# EasyEDA Pro project ProPrj_nigeria__2025-12-29.epro, schematic Schematic1

## Sheets
1 P1: Board Name: Board1; Create Date: 2025-03-15; Page Name: P1; Project Name: nigeria_; Schematic Name: Schematic1; Update Date: 2025-03-15; Company: EasyEDA.com; Page Size: A4; Version: V1.0
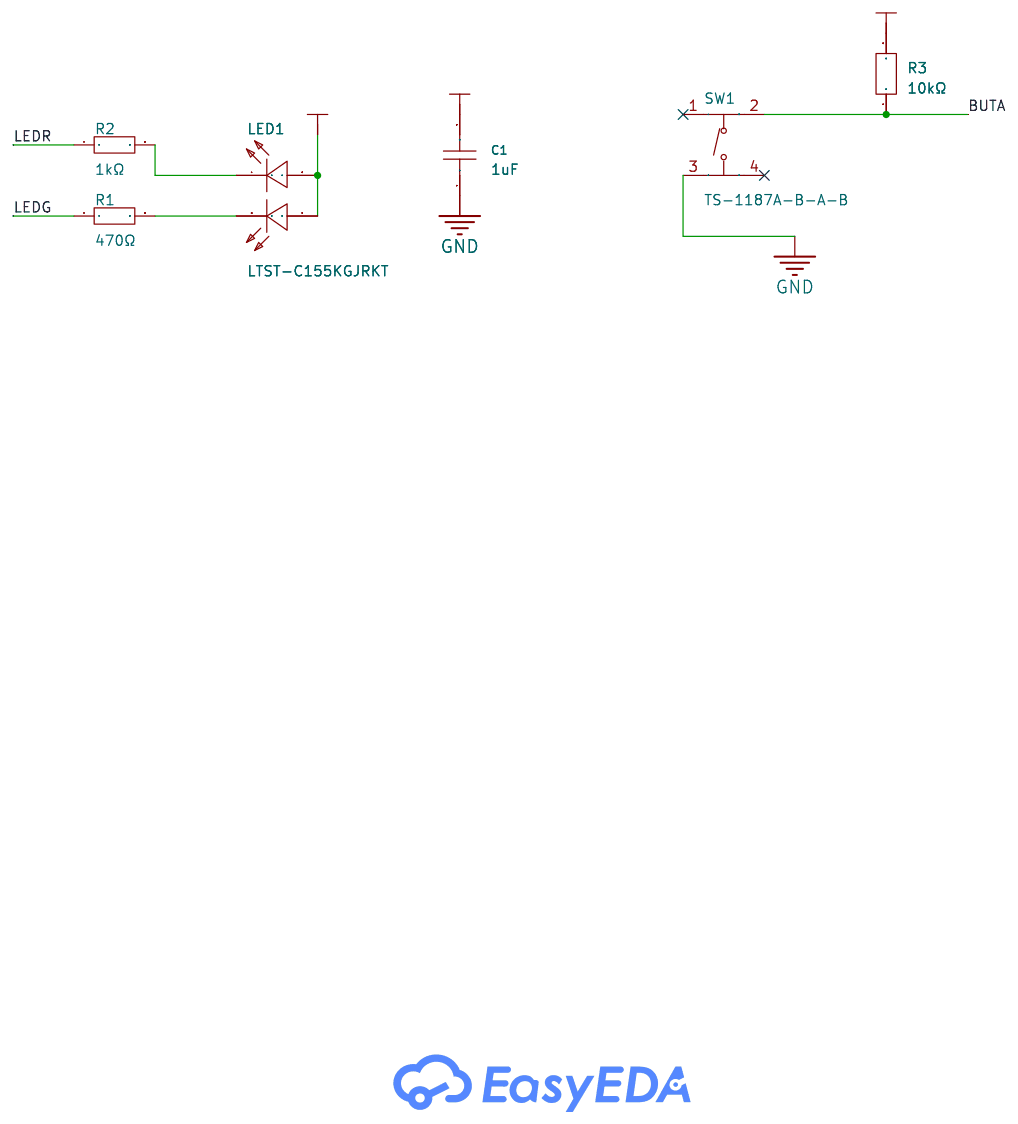
[diagram p0: P1]
2 P2: Page Name: P2; Update Date: 2025-03-19
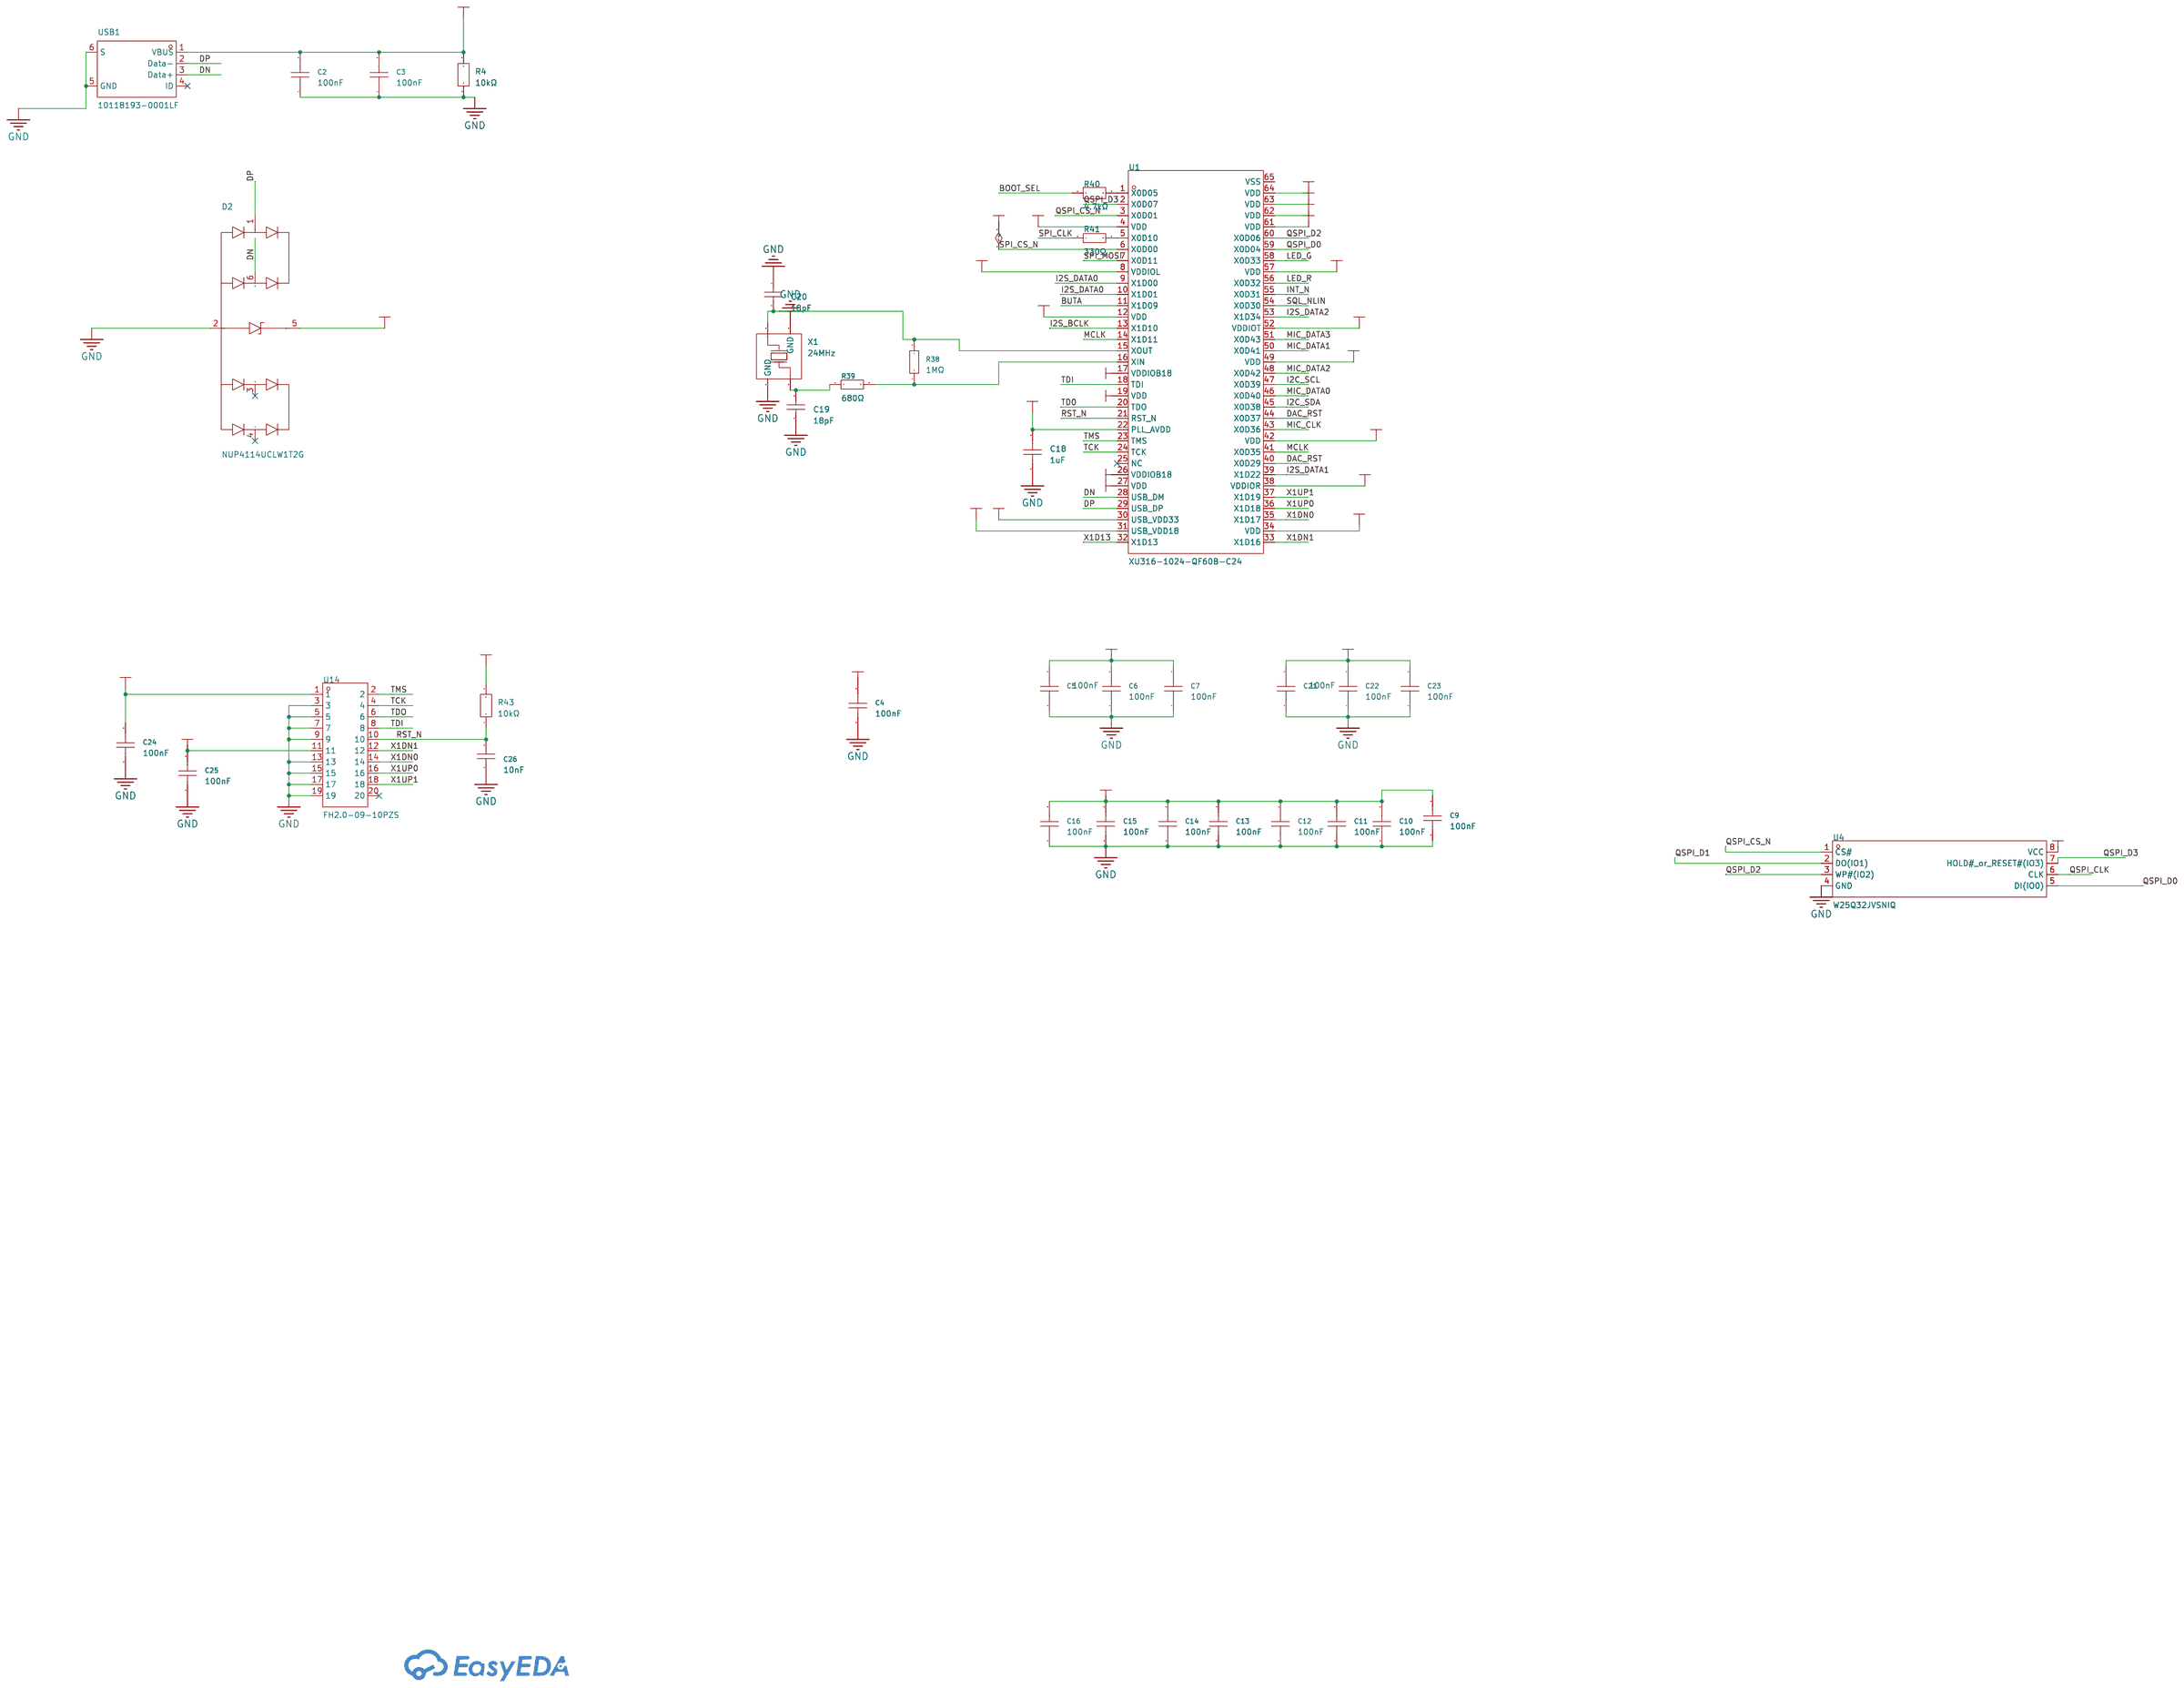
[diagram p1: P2]
3 P3: Page Name: P3; Update Date: 2025-03-16
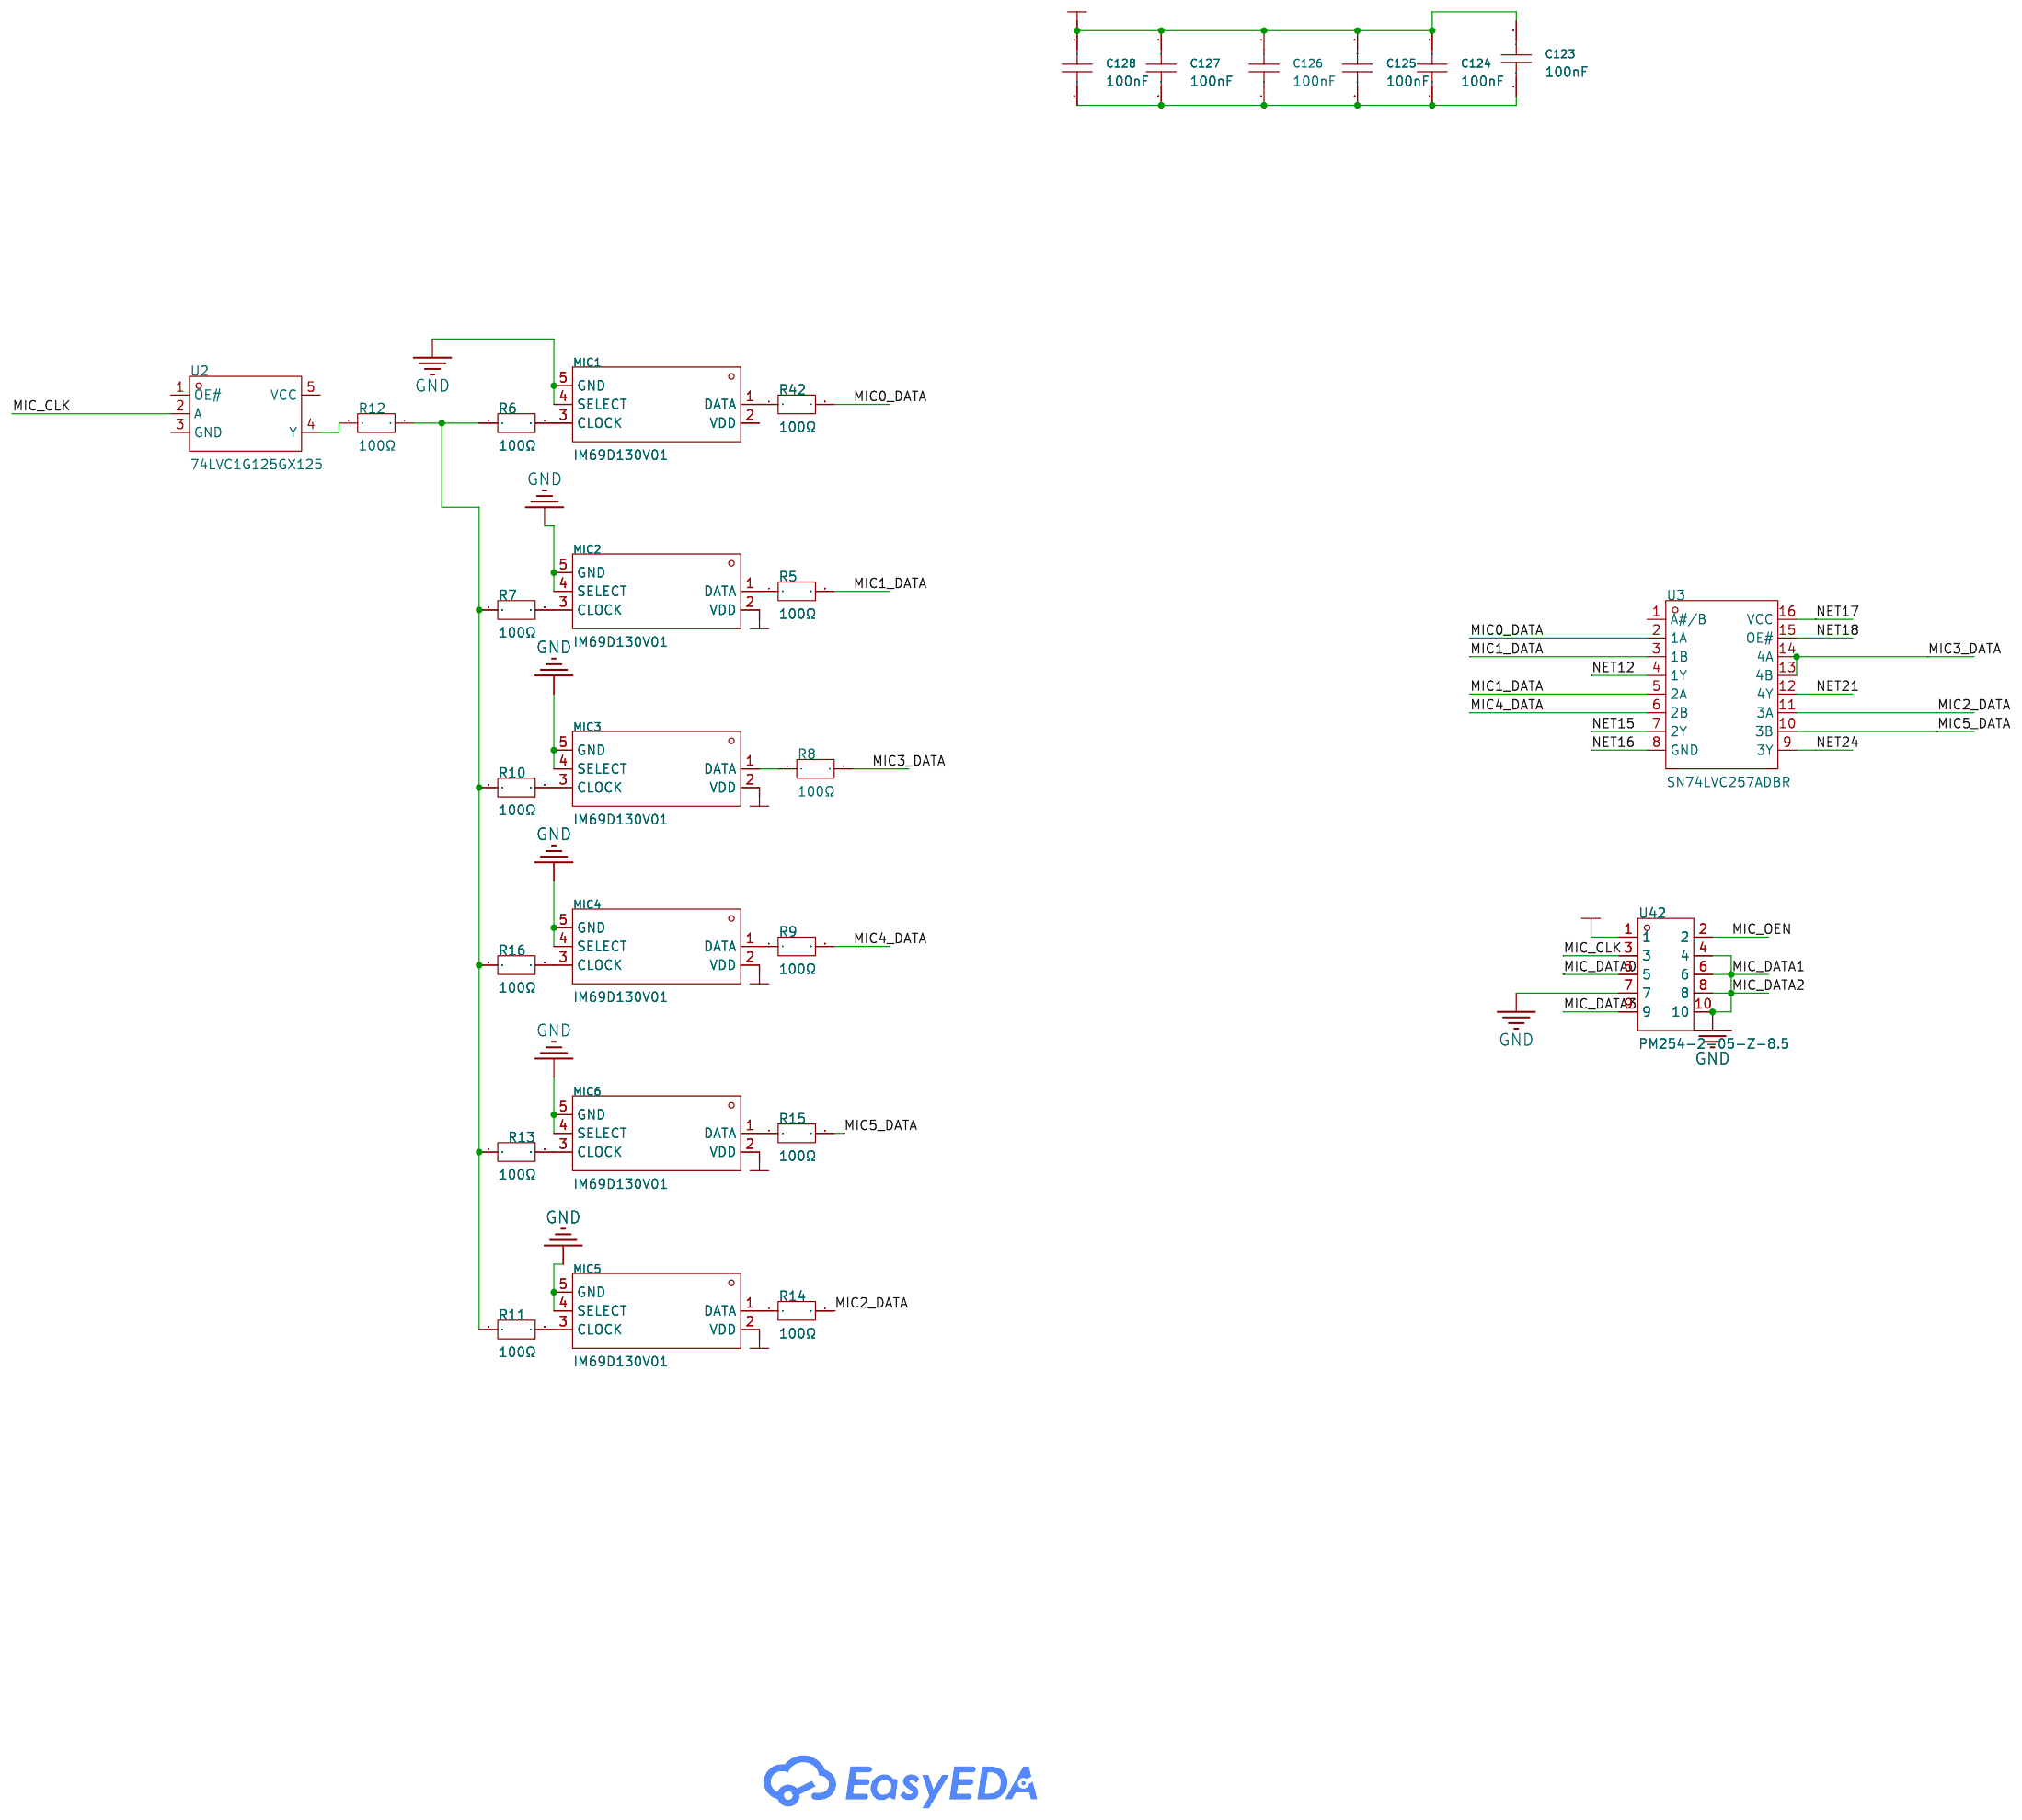
[diagram p2: P3]
4 P4: Page Name: P4; Update Date: 2025-03-16
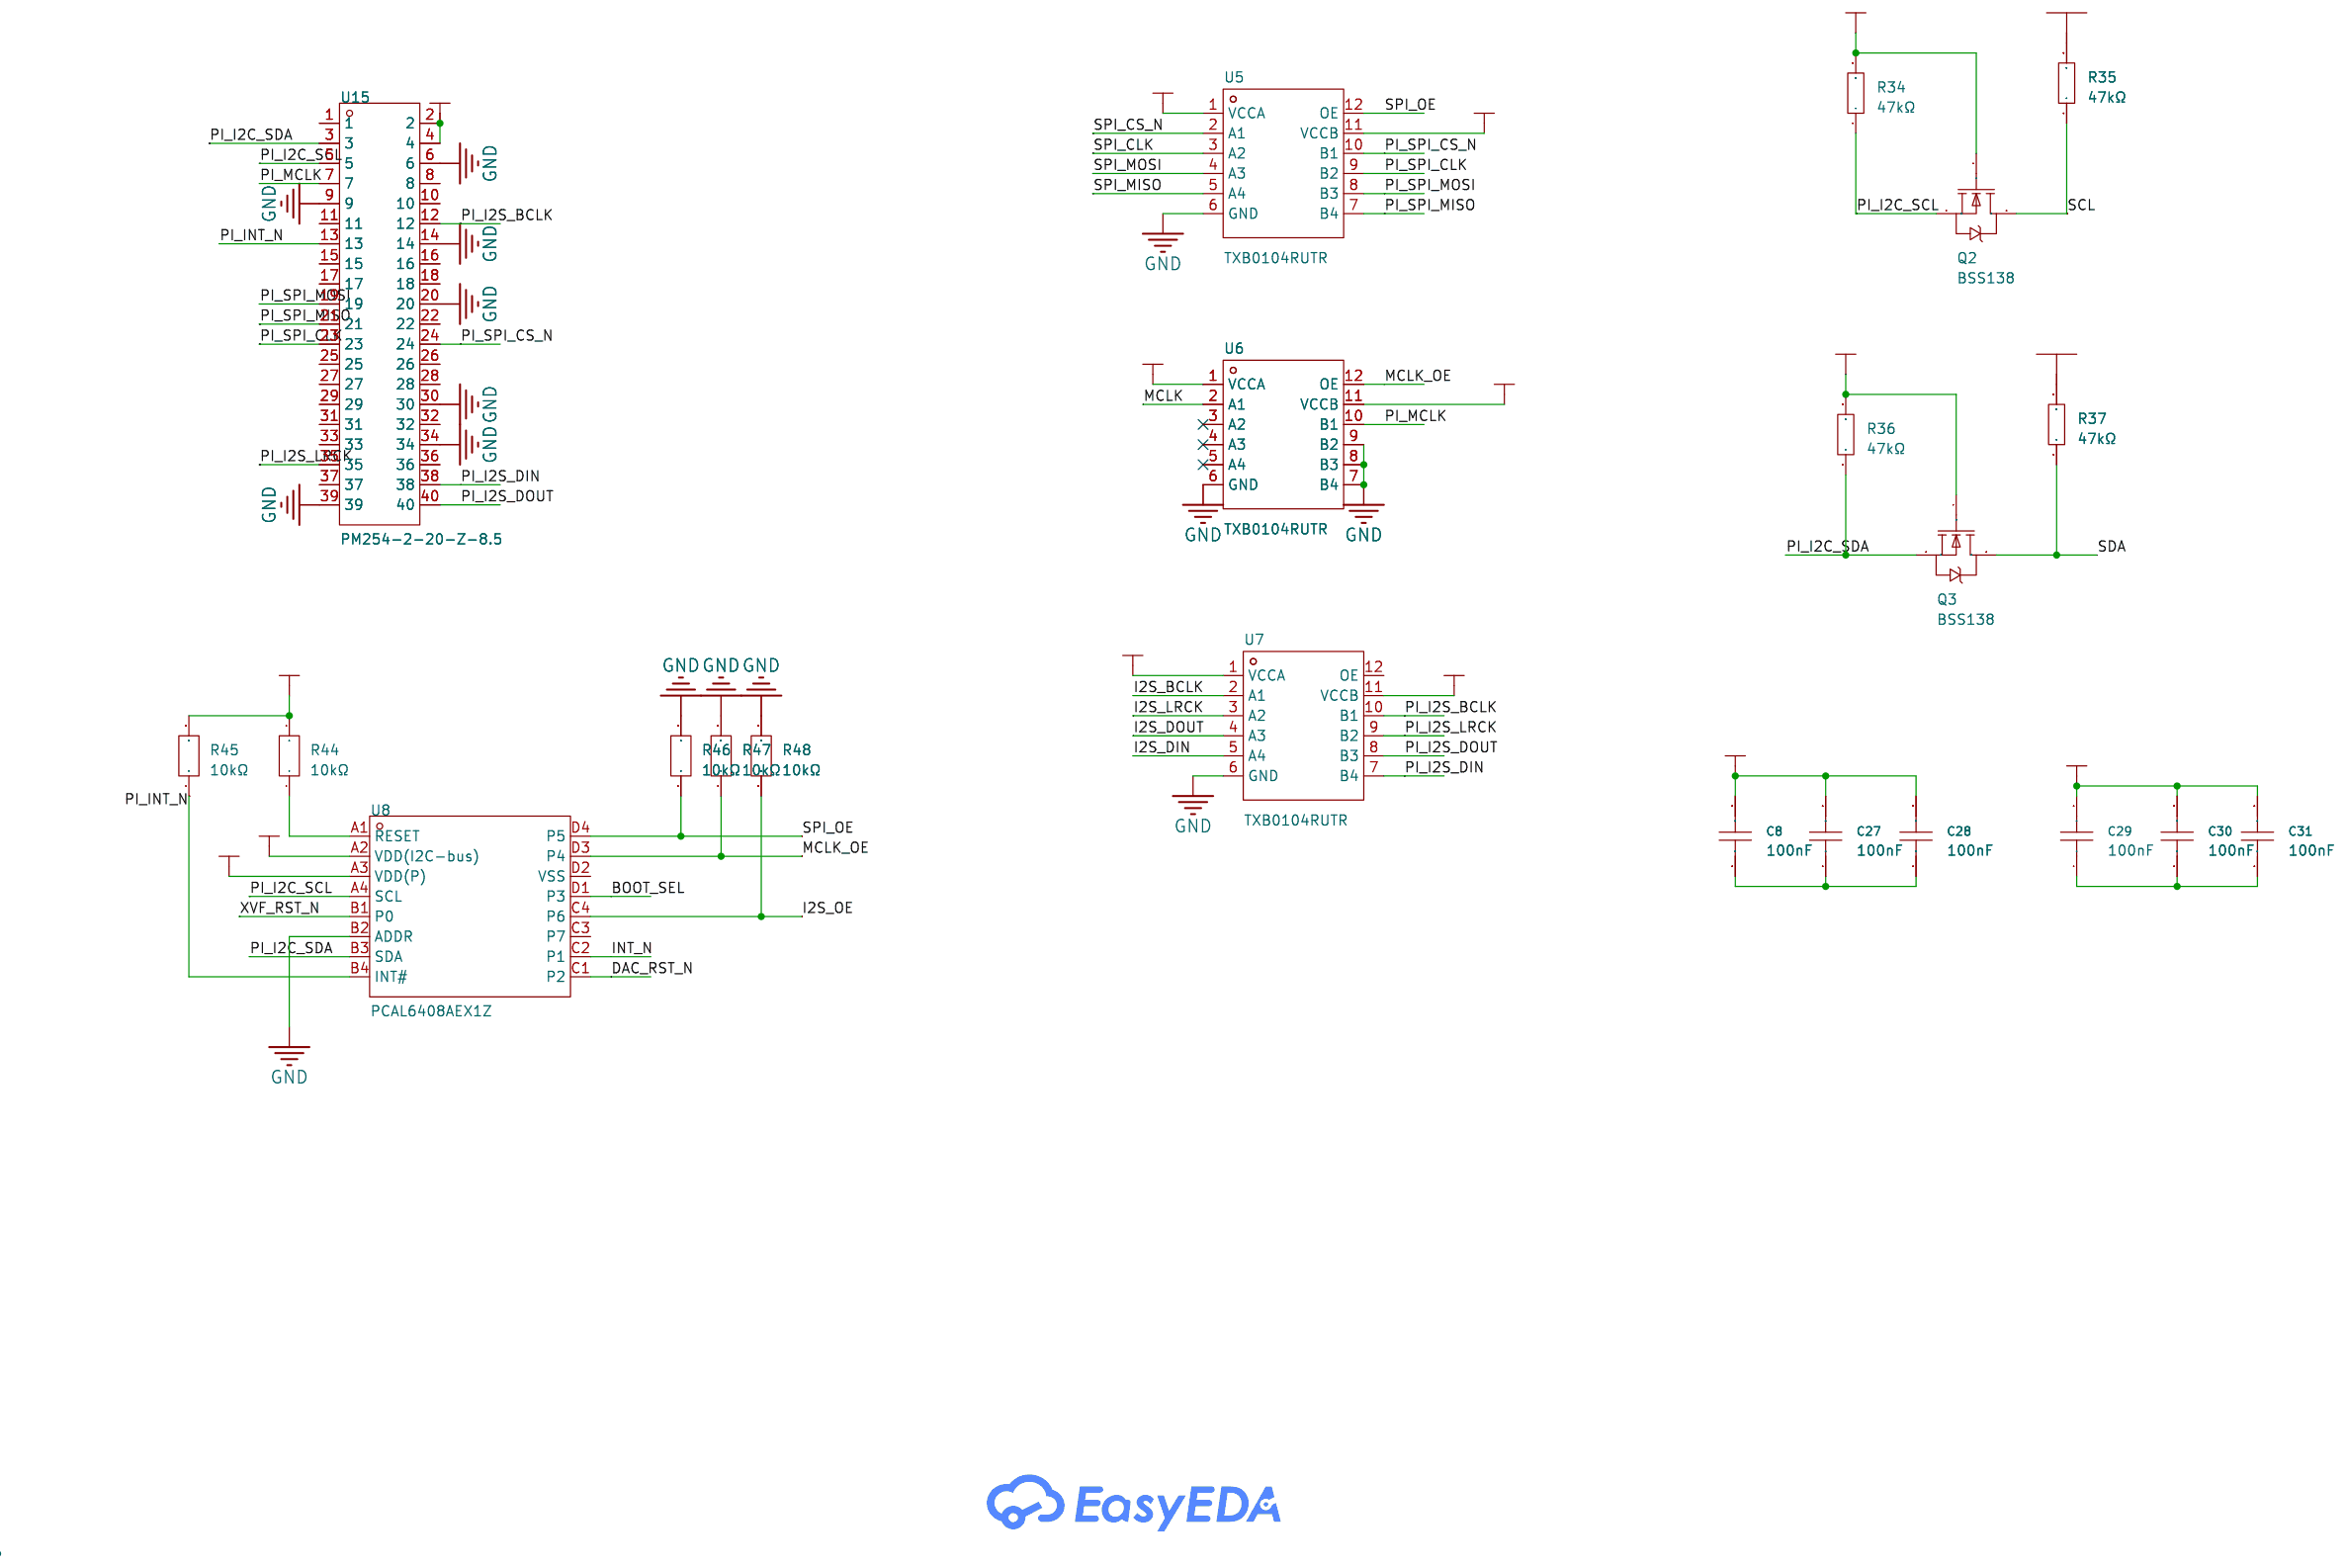
[diagram p3: P4]
5 P5: Page Name: P5; Update Date: 2025-03-16
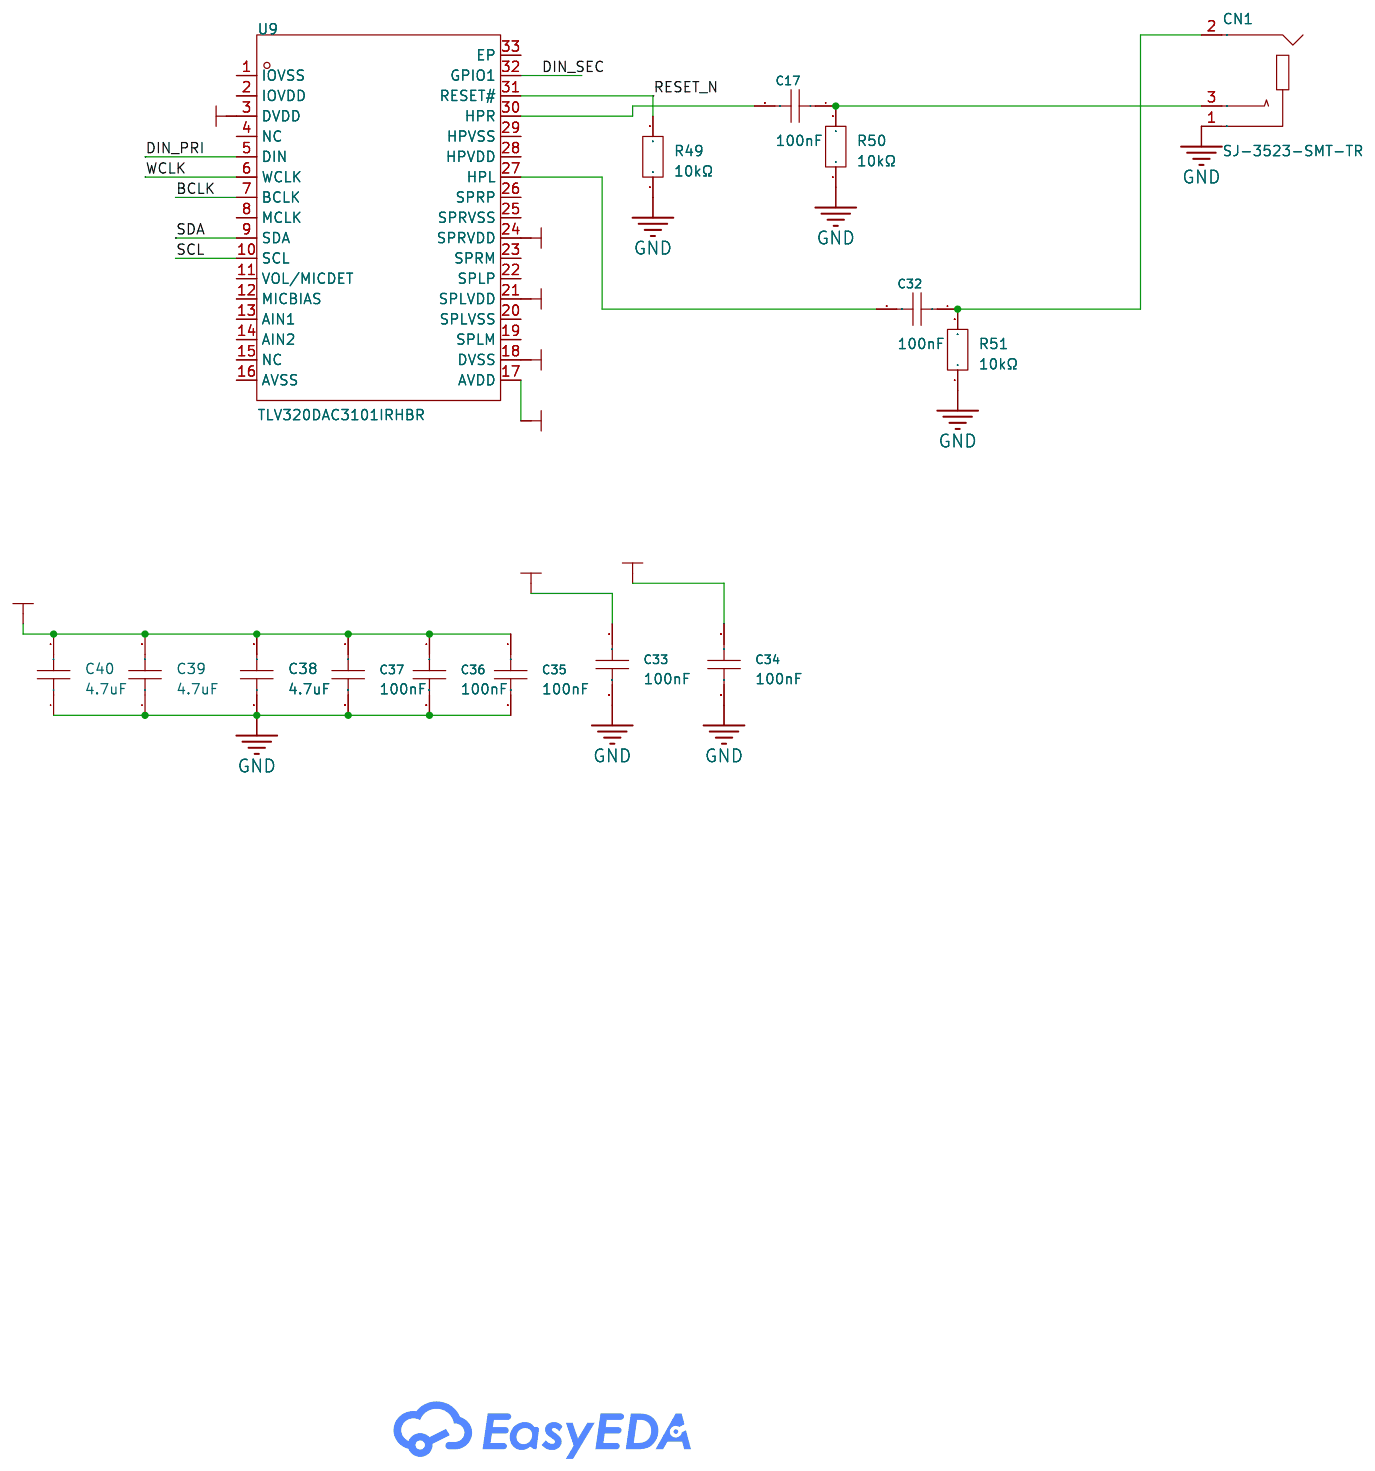
[diagram p4: P5]
6 P6: Page Name: P6; Update Date: 2025-03-16
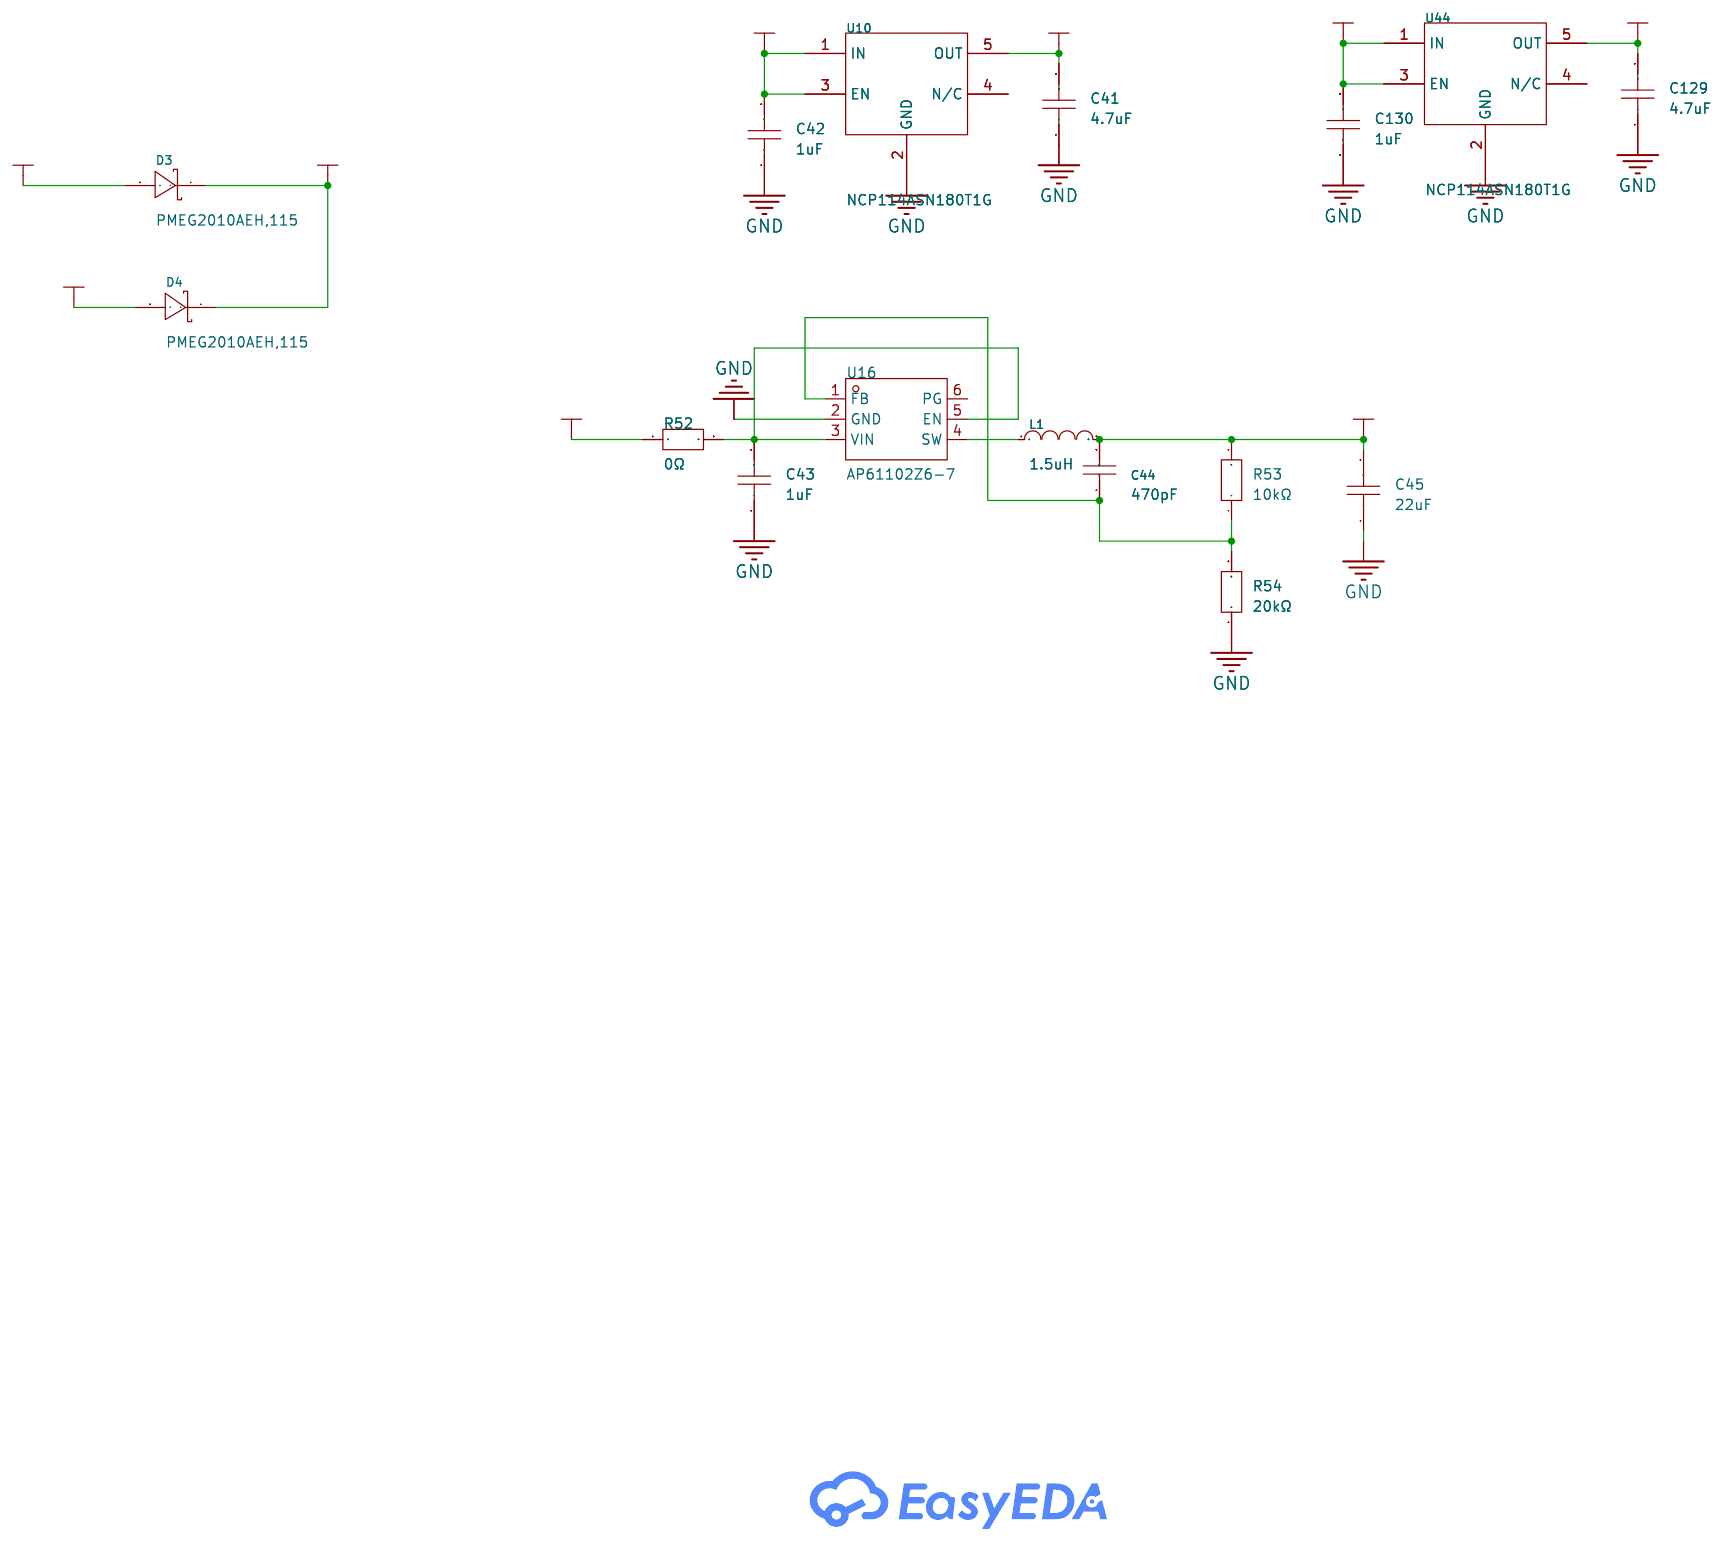
[diagram p5: P6]
7 P7: Create Date: 2025-03-16; Page Name: P7; Update Date: 2025-03-16
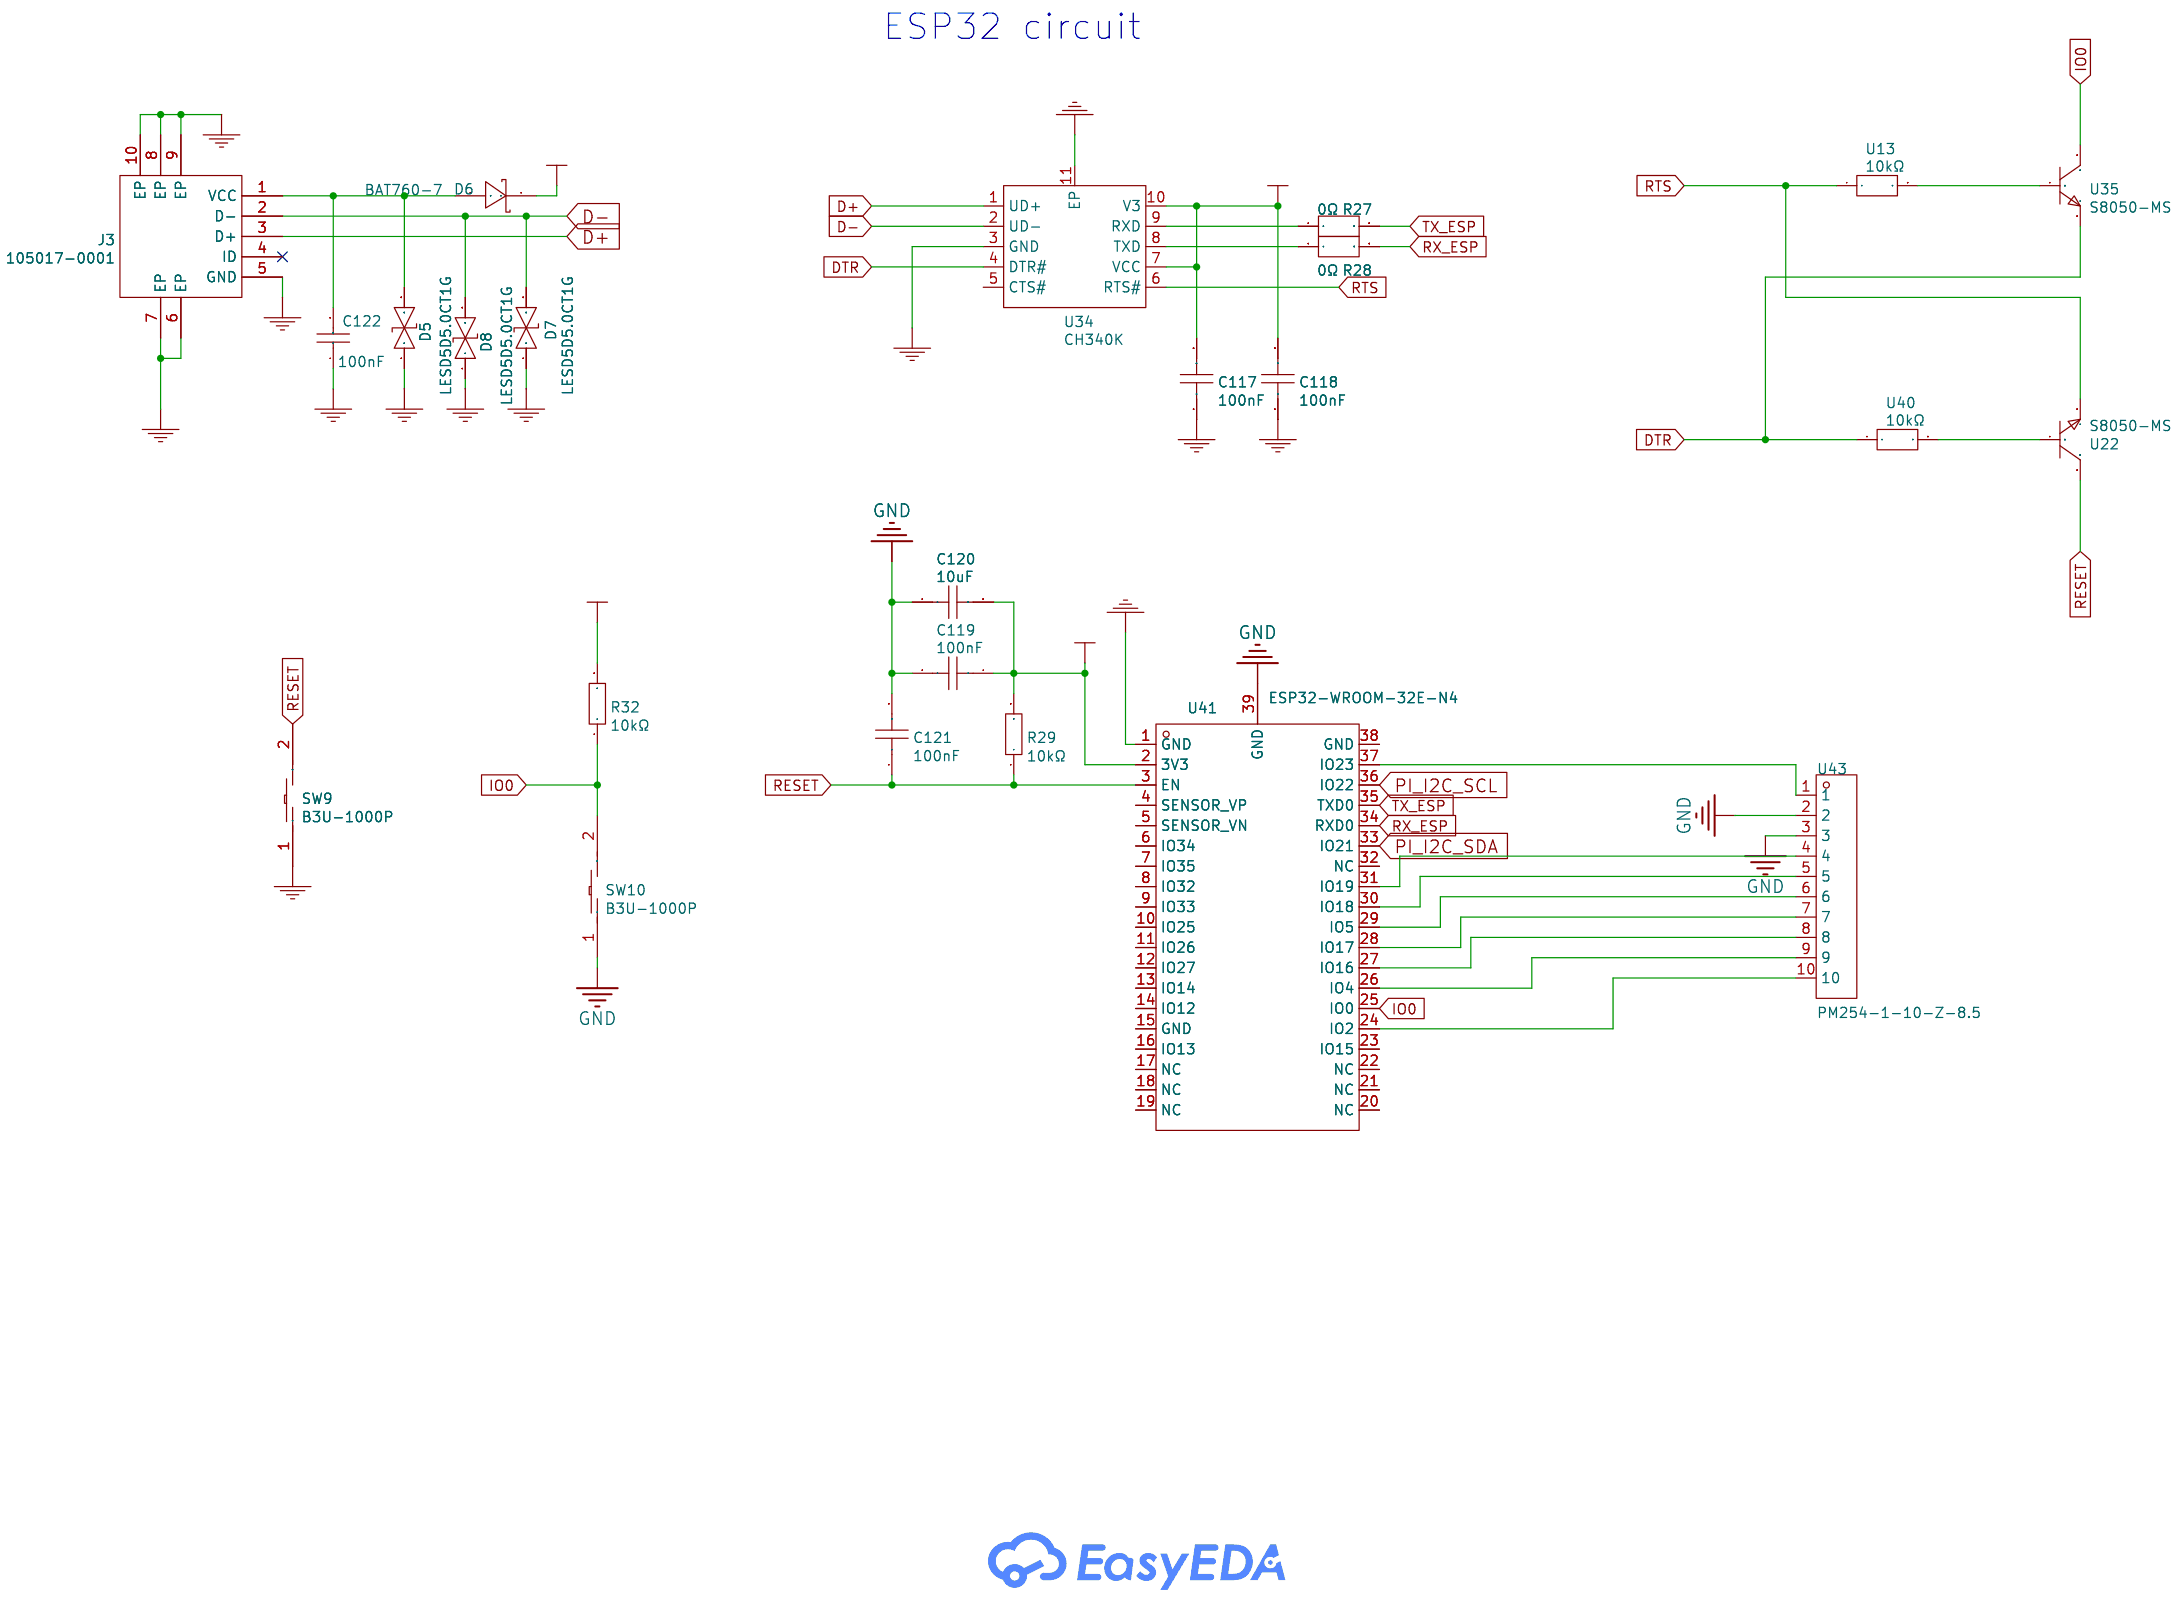
[diagram p6: P7]

## Parts
sheet P1
C1  1uF  [C0603]
LED1  LTST-C155KGJRKT  [LED-ARRAY-SMD_4P-L3.2-W2.7-BR]
R1  470Ω  [R0603]
R2  1kΩ  [R0603]
R3  10kΩ  [R0603]
SW1  TS-1187A-B-A-B  [SW-SMD_4P-L5.1-W5.1-P3.70-LS6.5-TL_H1.5]
sheet P2
C2  100nF  [C0603]
C3  100nF  [C0603]
C4  100nF  [C0603]
C5  100nF  [C0603]
C6  100nF  [C0603]
C7  100nF  [C0603]
C9  100nF  [C0603]
C10  100nF  [C0603]
C11  100nF  [C0603]
C12  100nF  [C0603]
C13  100nF  [C0603]
C14  100nF  [C0603]
C15  100nF  [C0603]
C16  100nF  [C0603]
C18  1uF  [C0603]
C19  18pF  [C0603]
C20  18pF  [C0603]
C21  100nF  [C0603]
C22  100nF  [C0603]
C23  100nF  [C0603]
C24  100nF  [C0603]
C25  100nF  [C0603]
C26  10nF  [C0603]
D2  NUP4114UCLW1T2G  [SOT-363-6_L2.0-W1.3-P0.65-LS2.3-BL]
R4  10kΩ  [R0603]
R38  1MΩ  [R0603]
R39  680Ω  [R0805]
R40  4.7kΩ  [R0603]
R41  330Ω  [R0603]
R43  10kΩ  [R0603]
U1  XU316-1024-QF60B-C24  [QFN-60_L7.0-W7.0-P0.40-TL-EP_XU316-1024]
U4  W25Q32JVSNIQ  [SOP-8_L4.9-W3.9-P1.27-LS6.0-BL]
U14  FH2.0-09-10PZS  [HDR-TH_20P-P2.00-V-F-R2-C10-S2.00-3]
USB1  10118193-0001LF  [MICRO-USB-SMD_10118193-0001LF]
X1  24MHz  [CRYSTAL-SMD_4P-L3.2-W2.5-BL-1]
sheet P3
C123  100nF  [C0603]
C124  100nF  [C0603]
C125  100nF  [C0603]
C126  100nF  [C0603]
C127  100nF  [C0603]
C128  100nF  [C0603]
MIC1  IM69D130V01  [MIC-SMD_5P-L4.0-W3.0-P0.70-TR_IM69D130V01]
MIC2  IM69D130V01  [MIC-SMD_5P-L4.0-W3.0-P0.70-TR_IM69D130V01]
MIC3  IM69D130V01  [MIC-SMD_5P-L4.0-W3.0-P0.70-TR_IM69D130V01]
MIC4  IM69D130V01  [MIC-SMD_5P-L4.0-W3.0-P0.70-TR_IM69D130V01]
MIC5  IM69D130V01  [MIC-SMD_5P-L4.0-W3.0-P0.70-TR_IM69D130V01]
MIC6  IM69D130V01  [MIC-SMD_5P-L4.0-W3.0-P0.70-TR_IM69D130V01]
R5  100Ω  [R0603]
R6  100Ω  [R0603]
R7  100Ω  [R0603]
R8  100Ω  [R0603]
R9  100Ω  [R0603]
R10  100Ω  [R0603]
R11  100Ω  [R0603]
R12  100Ω  [R0603]
R13  100Ω  [R0603]
R14  100Ω  [R0603]
R15  100Ω  [R0603]
R16  100Ω  [R0603]
R42  100Ω  [R0603]
U2  74LVC1G125GX125  [X2SON-5_L0.8-W0.8-P0.48-BL-EP]
U3  SN74LVC257ADBR  [SSOP-16_L6.2-W5.3-P0.65-LS7.8-BL]
U42  PM254-2-05-Z-8.5  [HDR-TH_10P-P2.54-V-F-R2-C5-S2.54]
sheet P4
C8  100nF  [C0603]
C27  100nF  [C0603]
C28  100nF  [C0603]
C29  100nF  [C0603]
C30  100nF  [C0603]
C31  100nF  [C0603]
Q2  BSS138  [SOT-23-3_L2.9-W1.6-P1.90-LS2.8-BR]
Q3  BSS138  [SOT-23-3_L2.9-W1.6-P1.90-LS2.8-BR]
R34  47kΩ  [R0603]
R35  47kΩ  [R0603]
R36  47kΩ  [R0603]
R37  47kΩ  [R0603]
R44  10kΩ  [R0603]
R45  10kΩ  [R0603]
R46  10kΩ  [R0603]
R47  10kΩ  [R0603]
R48  10kΩ  [R0603]
U5  TXB0104RUTR  [UQFN-12_L2.0-W1.7-P0.40-BL]
U6  TXB0104RUTR  [UQFN-12_L2.0-W1.7-P0.40-BL]
U7  TXB0104RUTR  [UQFN-12_L2.0-W1.7-P0.40-BL]
U8  PCAL6408AEX1Z  [X2QFN-16_L1.6-W1.6-R4-C4-P0.4-TL]
U15  PM254-2-20-Z-8.5  [HDR-TH_40P-P2.54-V-F-R2-C20-S2.54]
sheet P5
C17  100nF  [C0603]
C32  100nF  [C0603]
C33  100nF  [C0603]
C34  100nF  [C0603]
C35  100nF  [C0603]
C36  100nF  [C0603]
C37  100nF  [C0603]
C38  4.7uF  [C0603]
C39  4.7uF  [C0603]
C40  4.7uF  [C0603]
CN1  SJ-3523-SMT-TR  [AUDIO-SMD_SJ-3523-SMT-TR]
R49  10kΩ  [R0603]
R50  10kΩ  [R0603]
R51  10kΩ  [R0603]
U9  TLV320DAC3101IRHBR  [VQFN-32_L5.0-W5.0-P0.50-TL-EP3.5]
sheet P6
C41  4.7uF  [C0603]
C42  1uF  [C0603]
C43  1uF  [C0603]
C44  470pF  [C0603]
C45  22uF  [C0603]
C129  4.7uF  [C0603]
C130  1uF  [C0603]
D3  PMEG2010AEH,115  [SOD-123F_L2.8-W1.8-LS3.7-RD]
D4  PMEG2010AEH,115  [SOD-123F_L2.8-W1.8-LS3.7-RD]
L1  1.5uH  [L0806]
R52  0Ω  [R0603]
R53  10kΩ  [R0603]
R54  20kΩ  [R0603]
U10  NCP114ASN180T1G  [TSOP-5_L3.0-W1.5-P0.95-LS2.8-BR]
U16  AP61102Z6-7  [SOT-563-6_L1.6-W1.2-P0.50-LS1.6-BL]
U44  NCP114ASN180T1G  [TSOP-5_L3.0-W1.5-P0.95-LS2.8-BR]
sheet P7
C117  100nF  [C0603]
C118  100nF  [C0603]
C119  100nF  [C0603]
C120  10uF  [C0603]
C121  100nF  [C0603]
C122  100nF  [C0402_NEW]
D5  LESD5D5.0CT1G  [SOD-523_L1.2-W0.8-LS1.6-BI]
D6  BAT760-7  [SOD-323_L1.8-W1.3-LS2.5-RD]
D7  LESD5D5.0CT1G  [SOD-523_L1.2-W0.8-LS1.6-BI]
D8  LESD5D5.0CT1G  [SOD-523_L1.2-W0.8-LS1.6-BI]
J3  105017-0001  [MICRO-USB-SMD_105017-0001]
R27  0Ω  [R0603]
R28  0Ω  [R0603]
R29  10kΩ  [R0603]
R32  10kΩ  [R0603]
SW9  B3U-1000P  [KEY-SMD_B3U-1000PM]
SW10  B3U-1000P  [KEY-SMD_B3U-1000PM]
U13  10kΩ  [R0603]
U22  S8050-MS  [SOT-23-3_L2.9-W1.3-P1.90-LS2.4-BR]
U34  CH340K  [ESOP-10_L4.9-W3.9-P1.00-LS6.2-BL-EP]
U35  S8050-MS  [SOT-23-3_L2.9-W1.3-P1.90-LS2.4-BR]
U40  10kΩ  [R0603]
U41  ESP32-WROOM-32E-N4  [WIFI-SMD_ESP32-WROOM-32E]
U43  PM254-1-10-Z-8.5  [HDR-TH_10P-P2.54-V-F]

## Library data of the parts
C1 = TCC0603X5R105K250CT: Capacitance:1uF Tolerance:±10% Tolerance:±10% Voltage Rated: Temperature Coefficient:; LCSC Part Name: 1uF ±10% 25V; Supplier Part: C696843; Manufacturer: CCTC(三环); Supplier Footprint: 0603; JLCPCB Part Class: Extended Part; Datasheet: https://atta.szlcsc.com/upload/public/pdf/source/20200707/C696841_89A2C111301AB76AE7642008585E7A11.pdf; Supplier: LCSC; Tolerance: ±10%
LED1 = LTST-C155KGJRKT: Emitted Color:Red,Green-yellow Forward Voltage (VF):2V；2V Forward Voltage (VF):2V；2V Power Dissipation:75mW Forward Current:20mA Dominant Wavelength:571nm；631nm Dominant Wavelength:571nm；631nm Peak Wavelength:639nm；574nm Diode Configuration:- Lens Color:无; LCSC Part Name: 红灯,普绿/黄绿; Supplier Part: C115448; Manufacturer: LITEON(光宝); Supplier Footprint: 1210; JLCPCB Part Class: Extended Part; Datasheet: https://atta.szlcsc.com/upload/public/pdf/source/20170616/1497588043425.pdf; Supplier: LCSC; Emitted Color: Red,Green-yellow; Forward Voltage (VF): 2V；2V; Power Dissipation: 75mW; Forward Current: 20mA; Dominant Wavelength: 571nm；631nm; Peak Wavelength: 639nm；574nm; Lens Color: 无色透明透镜; Luminous Intensity: 45mcd；35mcd; Viewing Angle: 130°; Operating Temperature: -55℃~+85℃
R1 = ARG03FTC4700: Type:Thin Film Resistor Resistance: Tolerance:±1% Tolerance:±1% Power(Watts): Overload Voltage (Max): Temperature Coefficient:±25ppm/℃ Temperature Coefficient:±25ppm/℃ Operating Temperature Range:-55℃~+155℃ Operating Temperature Range:-55℃~+155℃; LCSC Part Name: 薄膜电阻 470Ω ±1% 100mW; Supplier Part: C218042; Manufacturer: Viking(光颉); Supplier Footprint: 0603; JLCPCB Part Class: Extended Part; Datasheet: https://atta.szlcsc.com/upload/public/pdf/source/20200117/C485675_99063924B4564AF910B7BE66DA8EFA49.pdf; Supplier: LCSC; Type: Thin Film Resistor; Tolerance: ±1%; Temperature Coefficient: ±25ppm/℃; Operating Temperature Range: -55℃~+155℃
R2 = AF0603FR-071KL: Type:Thick Film Resistors Resistance: Tolerance:±1% Tolerance:±1% Power(Watts): Overload Voltage (Max): Temperature Coefficient:±100ppm/℃ Temperature Coefficient:±100ppm/℃ Operating Temperature Range:-55℃~+155℃ Operating Temperature Range:-55℃~+155℃; LCSC Part Name: 厚膜电阻 1kΩ ±1% 100mW; Supplier Part: C144087; Manufacturer: YAGEO(国巨); Supplier Footprint: 0603; JLCPCB Part Class: Extended Part; Datasheet: https://atta.szlcsc.com/upload/public/pdf/source/20180521/C192909_BA60B361D36B958A4E76614D266D209B.pdf; Supplier: LCSC; Type: Thick Film Resistors; Tolerance: ±1%; Temperature Coefficient: ±100ppm/℃; Operating Temperature Range: -55℃~+155℃
R3 R4 R53 = RMCF0603FT10K0: Type:Thick Film Resistors Resistance:10kΩ Tolerance:±1% Tolerance:±1% Power(Watts):100mW Voltage-Supply(Max):75V Temperature Coefficient:±100ppm/℃ Temperature Coefficient:±100ppm/℃ Operating Temperature:-55℃~+155℃ Operating Temperature:-55℃~+155℃; LCSC Part Name: 厚膜电阻 10kΩ ±1% 100mW; Supplier Part: C2479067; Manufacturer: SEI(Stackpole Electronics Inc.); Supplier Footprint: 0603; JLCPCB Part Class: Extended Part; Datasheet: https://atta.szlcsc.com/upload/public/pdf/source/20210416/08FD20E6270D8D7CE8DA16B611AFBC44.pdf; Supplier: LCSC; Type: Thick Film Resistors; Tolerance: ±1%; Power(Watts): 100mW; Voltage-Supply(Max): 75V; Temperature Coefficient: ±100ppm/℃; Operating Temperature: -55℃~+155℃
SW1 = TS-1187A-B-A-B: Circuit:SPST Actuator Style:Round Button Operating Force:160gf Mounting Style:Brick nogging Switch Length:5.1mm Switch Width:5.1mm Switch Height:1.5mm Strike Gundam:不带 Contact Current:50mA Voltage Rating (DC):12V Insulation Resistance:- Actuator/Cap Color; LCSC Part Name: 5.1*5.1*1.5mm 立贴 轻触开关; Supplier Part: C318884; Manufacturer: XKB Connectivity(中国星坤); Supplier Footprint: SMD; JLCPCB Part Class: Basic Part; Datasheet: https://atta.szlcsc.com/upload/public/pdf/source/20200227/C318890_053E50208A88A7BA1965D8746000774E.pdf; Supplier: LCSC; Circuit: SPST; Actuator Style: Round Button; Operating Force: 160gf; Mounting Style: Brick nogging; Switch Length: 5.1mm; Switch Width: 5.1mm; Switch Height: 1.5mm; Strike Gundam: 不带; Contact Current: 50mA; Voltage Rating (DC): 12V; Actuator/Cap Color: 金色; With Lamp: No; Mechanical Life: 10万次; Operating Temperature: -30℃~+85℃
C2-C17 C21-C25 C27-C37 C123-C128 = TCC0603X7R104K101CT: Capacitance:100nF Tolerance:±10% Tolerance:±10% Voltage Rated: Temperature Coefficient:; LCSC Part Name: 100nF ±10% 100V; Supplier Part: C696916; Manufacturer: CCTC(三环); Supplier Footprint: 0603; JLCPCB Part Class: Extended Part; Datasheet: https://atta.szlcsc.com/upload/public/pdf/source/20200707/C696841_89A2C111301AB76AE7642008585E7A11.pdf; Supplier: LCSC; Tolerance: ±10%
C18 C42 C43 C130 = CL10A105KB8NNNC: Capacitance: Tolerance:±10% Tolerance:±10% Voltage Rated: Temperature Coefficient:; LCSC Part Name: 1uF ±10% 50V; Supplier Part: C15849; Manufacturer: SAMSUNG(三星); Supplier Footprint: 0603; JLCPCB Part Class: Basic Part; Datasheet: https://atta.szlcsc.com/upload/public/pdf/source/20160218/1457707763339.pdf; Supplier: LCSC; Tolerance: ±10%
C19 C20 = CL10C180JB8NNNC: Capacitance: Tolerance:±5% Tolerance:±5% Voltage Rated: Temperature Coefficient:; LCSC Part Name: 18pF ±5% 50V; Supplier Part: C1647; Manufacturer: SAMSUNG(三星); Supplier Footprint: 0603; JLCPCB Part Class: Basic Part; Datasheet: https://atta.szlcsc.com/upload/public/pdf/source/20160218/1457707763339.pdf; Supplier: LCSC; Tolerance: ±5%
C26 = 0603B103K500NT: Capacitance:10nF Tolerance:±10% Tolerance:±10% Voltage Rated: Temperature Coefficient:; LCSC Part Name: 10nF ±10% 50V; Supplier Part: C57112; Manufacturer: FH(风华); Supplier Footprint: 0603; JLCPCB Part Class: Basic Part; Datasheet: https://atta.szlcsc.com/upload/public/pdf/source/20200305/C486355_26A10D38EF8C2A5C37091D0039909270.pdf; Supplier: LCSC; Tolerance: ±10%
D2 = NUP4114UCLW1T2G: Supplier Part: C3040619; Manufacturer: TECH PUBLIC(台舟); Supplier Footprint: SOT-363; JLCPCB Part Class: Extended Part; Datasheet: https://atta.szlcsc.com/upload/public/pdf/source/20220624/4893F3579401D3D0BE1B1839A47073BC.pdf; Supplier: LCSC
R38 = 0603WAF1004T5E: Type:Thick Film Resistors Resistance:1MΩ Tolerance:±1% Tolerance:±1% Power(Watts): Overload Voltage (Max): Temperature Coefficient:±100ppm/℃ Temperature Coefficient:±100ppm/℃ Operating Temperature Range:-55℃~+155℃ Operating Temperature Range:-55℃~+155℃; LCSC Part Name: 1MΩ ±1% 100mW 厚膜电阻; Supplier Part: C22935; Manufacturer: UNI-ROYAL(厚声); Supplier Footprint: 0603; JLCPCB Part Class: Basic Part; Datasheet: https://atta.szlcsc.com/upload/public/pdf/source/20200306/C422600_1E6D84923E4A46A82E41ADD87F860B5C.pdf; Supplier: LCSC; Type: Thick Film Resistors; Tolerance: ±1%; Temperature Coefficient: ±100ppm/℃; Operating Temperature Range: -55℃~+155℃
R39 = 0805W8F6800T5E: Type:Thick Film Resistors Resistance: Tolerance:±1% Tolerance:±1% Power(Watts): Overload Voltage (Max): Temperature Coefficient:±100ppm/℃ Temperature Coefficient:±100ppm/℃ Operating Temperature Range:-55℃~+155℃ Operating Temperature Range:-55℃~+155℃; LCSC Part Name: 680Ω ±1% 125mW 厚膜电阻; Supplier Part: C17798; Manufacturer: UNI-ROYAL(厚声); Supplier Footprint: 0805; JLCPCB Part Class: Basic Part; Datasheet: https://atta.szlcsc.com/upload/public/pdf/source/20200306/C422600_1E6D84923E4A46A82E41ADD87F860B5C.pdf; Supplier: LCSC; Type: Thick Film Resistors; Tolerance: ±1%; Temperature Coefficient: ±100ppm/℃; Operating Temperature Range: -55℃~+155℃
R40 = PTFR0603B4K70N9: Type:Thin Film Resistor Resistance: Tolerance:±0.1% Tolerance:±0.1% Power(Watts): Overload Voltage (Max): Temperature Coefficient:±10ppm/℃ Temperature Coefficient:±10ppm/℃ Operating Temperature Range:-55℃~+125℃ Operating Temperature Range:-55℃~+125℃; LCSC Part Name: 薄膜电阻 4.7kΩ ±0.1% 100mW; Supplier Part: C394547; Manufacturer: RESI(开步睿思); Supplier Footprint: 0603; JLCPCB Part Class: Extended Part; Datasheet: https://atta.szlcsc.com/upload/public/pdf/source/20240506/11BDC7478D84177AC2A5326A65B6EB29.pdf; Supplier: LCSC; Type: Thin Film Resistor; Tolerance: ±0.1%; Temperature Coefficient: ±10ppm/℃; Operating Temperature Range: -55℃~+125℃
R41 = ERA3VEB3300V: Type:Thin Film Resistor Resistance: Tolerance:±0.1% Tolerance:±0.1% Power(Watts): Overload Voltage (Max): Temperature Coefficient:±25ppm/℃ Temperature Coefficient:±25ppm/℃ Operating Temperature Range:-55℃~+155℃ Operating Temperature Range:-55℃~+155℃; LCSC Part Name: 330Ω ±0.1% 125mW 薄膜电阻; Supplier Part: C490792; Manufacturer: PANASONIC(松下); Supplier Footprint: 0603; JLCPCB Part Class: Extended Part; Datasheet: https://atta.szlcsc.com/upload/public/pdf/source/20200407/C490792_05DE9D496394392417A8F1D76C29C6AE.pdf; Supplier: LCSC; Type: Thin Film Resistor; Tolerance: ±0.1%; Temperature Coefficient: ±25ppm/℃; Operating Temperature Range: -55℃~+155℃
R43-R51 = FRC0603J103 TS: Type:Thick Film Resistors Resistance:10kΩ Tolerance:±5% Tolerance:±5% Power(Watts):0.1W Voltage-Supply(Max):75V Temperature Coefficient:±100ppm/℃ Temperature Coefficient:±100ppm/℃ Operating Temperature:-55℃~+155℃ Operating Temperature:-55℃~+155℃; LCSC Part Name: 10kΩ ±5% 100mW 厚膜电阻; Supplier Part: C2930027; Manufacturer: FOJAN(富捷); Supplier Footprint: 0603; JLCPCB Part Class: Extended Part; Datasheet: https://atta.szlcsc.com/upload/public/pdf/source/20211221/925EC7D7225764EE0046F22065062C87.pdf; Supplier: LCSC; Type: Thick Film Resistors; Tolerance: ±5%; Power(Watts): 0.1W; Voltage-Supply(Max): 75V; Temperature Coefficient: ±100ppm/℃; Operating Temperature: -55℃~+155℃
U1 = XU316-1024-QF60B-C24: CPU Core:其他Series GPIO Ports Number:34 Operating Voltage Range:855mV~945mV Operating Voltage Range:855mV~945mV Operating Temperature Range:0℃~+70℃ Operating Temperature Range:0℃~+70℃ Universal Serial Bus:有 Secure Digital Input and Output:- Direct Memory A; Supplier Part: C6617472; Manufacturer: XMOS; Supplier Footprint: QFN-60(7x7); JLCPCB Part Class: Extended Part; Datasheet: https://atta.szlcsc.com/upload/public/pdf/source/231023/XU316-1024-QF60B-xcore_ai-Datasheet_3-575d86bd19ead95cec3cde265031b751.pdf; Supplier: LCSC; CPU Core: 其他Series; GPIO Ports Number: 34; Operating Voltage Range: 855mV~945mV; Operating Temperature Range: 0℃~+70℃; Universal Serial Bus: 有
U4 = W25Q32JVSNIQ: Interface Type:SPI Memory Size:32Mbit Clock Frequency (fc):133MHz Supply Voltage:2.7V~3.6V Supply Voltage:2.7V~3.6V Page Programming Time (Tpp):3ms Block Erase Time (tBE):120ms@(32KB) Data Retention - TDR (Year):20 years Operating Temperature:-40℃~+85℃ Op; Supplier Part: C5355146; Manufacturer: WINBOND(华邦); Supplier Footprint: SOIC-8-150mil; JLCPCB Part Class: Extended Part; Datasheet: https://atta.szlcsc.com/upload/public/pdf/source/20230606/FBA9C56AF53361B7D318374BE8E6F8B0.pdf; Supplier: LCSC; Interface Type: SPI; Memory Size: 32Mbit; Clock Frequency (fc): 133MHz; Supply Voltage: 2.7V~3.6V; Page Programming Time (Tpp): 3ms; Block Erase Time (tBE): 120ms@(32KB); Data Retention - TDR (Year): 20 years; Operating Temperature: -40℃~+85℃
U14 = FH2.0-09-10PZS: Holes Structure:2x10P Pitch:2mm Row Spacing:- Circular Hole / Square Hole:方孔 Mounting Type:Straight Number of Rows:双排 Number of Holes:20P Current Rating (Max):3A Voltage Rating (Max):- Holes Direction:Top Insulation Height:- Contact Material:- Contact Pla; LCSC Part Name: 2x10P 间距:2mm 直插; Supplier Part: C7500821; Manufacturer: XUNPU(讯普); Supplier Footprint: 插件,P=2mm; JLCPCB Part Class: Extended Part; Datasheet: https://atta.szlcsc.com/upload/public/pdf/source/20230809/22A67D23CFC6FA1A431BF8EBB035C258.pdf; Supplier: LCSC; Holes Structure: 2x10P; Pitch: 2mm; Circular Hole / Square Hole: 方孔; Mounting Type: Straight; Number of Rows: 双排; Number of Holes: 20P; Current Rating (Max): 3A; Holes Direction: Top; Operating Temperature Range: -40℃~+105℃
USB1 = 10118193-0001LF: Connector Type:Micro-B Standard:USB 2.0 Gender:Female Number of Ports:1 Number of Contacts:5P Mounting Style:卧贴 Current Rating - Power (Max):- Operating Temperature Range:-30℃~+80℃ Operating Temperature Range:-30℃~+80℃; LCSC Part Name: Micro-B 母 卧贴; Supplier Part: C132562; Manufacturer: Amphenol; Supplier Footprint: SMD; Datasheet: https://atta.szlcsc.com/upload/public/pdf/source/20180930/C132562_EF58E7CD8BC78D1A40A3413D0EBD3C52.pdf; Supplier: LCSC; Connector Type: Micro-B; Standard: USB 2.0; Gender: Female; Number of Ports: 1; Number of Contacts: 5P; Mounting Style: 卧贴; Operating Temperature Range: -30℃~+80℃
X1 = 7M24000067: Crystal Type:- Frequency:24MHz Normal temperature Frequency Tolerance:±10ppm Normal temperature Frequency Tolerance:±10ppm Load Capacitor: Frequency Stability:±10ppm Frequency Stability:±10ppm Operating Temperature: Operating Temperature:; LCSC Part Name: 24MHz ±10ppm 10pF; Supplier Part: C90910; Manufacturer: TXC(晶技); Supplier Footprint: SMD3225-4P; JLCPCB Part Class: Extended Part; Datasheet: https://atta.szlcsc.com/upload/public/pdf/source/20240312/35D13D5A102BE2B3CD5F5A63621F19A4.pdf; Supplier: LCSC; Normal temperature Frequency Tolerance: ±10ppm; Frequency Stability: ±10ppm
MIC1-MIC6 = IM69D130V01: Direction:全指向 Supply Voltage:1.8V Supply Voltage:1.8V Current Consumption:980uA；800uA；300uA；620uA Current Consumption:980uA；800uA；300uA；620uA SNR(Signal to Noise Ratio):66dB；64dB；68dB；69dB Sensitivity:-36dB Sensitivity:-36dB Impedance:-; Supplier Part: C536262; Manufacturer: Infineon(英飞凌); Supplier Footprint: SMD-5P,3x4mm; JLCPCB Part Class: Extended Part; Datasheet: https://atta.szlcsc.com/upload/public/pdf/source/20201028/C536262_1B49B2915D5ED63950CCDCE60C486821.pdf; Supplier: LCSC; Direction: 全指向; Supply Voltage: 1.8V; Current Consumption: 980uA；800uA；300uA；620uA; SNR(Signal to Noise Ratio): 66dB；64dB；68dB；69dB; Sensitivity: -36dB
R5-R16 R42 = CRCW0603100RJNEA: Type:Thick Film Resistors Resistance: Tolerance:±5% Tolerance:±5% Power(Watts): Overload Voltage (Max): Temperature Coefficient:±200ppm/℃ Temperature Coefficient:±200ppm/℃ Operating Temperature Range:-55℃~+155℃ Operating Temperature Range:-55℃~+155℃; LCSC Part Name: 厚膜电阻 100Ω ±5% 100mW; Supplier Part: C844726; Manufacturer: VISHAY(威世); Supplier Footprint: 0603; JLCPCB Part Class: Extended Part; Datasheet: https://atta.szlcsc.com/upload/public/pdf/source/20200927/C844919_23E7F5DF28E9421F105631C5C2D28736.pdf; Supplier: LCSC; Type: Thick Film Resistors; Tolerance: ±5%; Temperature Coefficient: ±200ppm/℃; Operating Temperature Range: -55℃~+155℃
U2 = 74LVC1G125GX125: Supplier Part: C4469927; Manufacturer: Nexperia(安世); Datasheet: https://atta.szlcsc.com/upload/public/pdf/source/20230809/80AA236568FE15A023B1C39B69273C6A.pdf; Supplier: LCSC
U3 = SN74LVC257ADBR: Supplier Part: C2873156; Manufacturer: TI(德州仪器); Supplier Footprint: SSOP-16-208mil; Datasheet: https://www.ti.com/cn/lit/gpn/sn74lvc257a; Supplier: LCSC
U42 = PM254-2-05-Z-8.5: Holes Structure:2x5P Pitch:2.54mm Row Spacing:2.54mm Circular Hole / Square Hole:Square Holes Mounting Type:Straight Number of Rows:双排 Number of Holes:10P Current Rating (Max):3A Voltage Rating (Max):- Holes Direction:Top Insulation Height:8.5mm Contact M; LCSC Part Name: 2x5P 间距:2.54mm 直插; Supplier Part: C2897406; Manufacturer: HCTL(华灿天禄); Supplier Footprint: 插件,P=2.54mm; JLCPCB Part Class: Extended Part; Datasheet: https://atta.szlcsc.com/upload/public/pdf/source/20230609/3D36CA2C1BFC9FD1C3F709AD9DFEB9C2.pdf; Supplier: LCSC; Holes Structure: 2x5P; Pitch: 2.54mm; Row Spacing: 2.54mm; Circular Hole / Square Hole: Square Holes; Mounting Type: Straight; Number of Rows: 双排; Number of Holes: 10P; Current Rating (Max): 3A; Holes Direction: Top; Insulation Height: 8.5mm; Contact Material: Copper Alloy; Operating Temperature Range: -40℃~+105℃; Soldering Temperature(Max): 260℃@5S
Q2 Q3 = BSS138_C52895: Type:1 N-Channel Drain Source Voltage (Vdss): Continuous Drain Current (Id):220mA Drain Source On Resistance (RDS(on)@Vgs,Id):3.5Ω@10V,0.22A Power Dissipation (Pd):360mW Gate Threshold Voltage (Vgs(th)@Id):1.5V@1mA Total Gate Charge (Qg@Vgs):2.4nC@25V Inp; LCSC Part Name: 1个N沟道 耐压:50V 电流:220mA; Supplier Part: C52895; Manufacturer: onsemi(安森美); Supplier Footprint: SOT-23; Datasheet: https://atta.szlcsc.com/upload/public/pdf/source/20170412/1491969107299.pdf; Supplier: LCSC; Type: 1 N-Channel; Continuous Drain Current (Id): 220mA; Drain Source On Resistance (RDS(on)@Vgs,Id): 3.5Ω@10V,0.22A; Power Dissipation (Pd): 360mW; Gate Threshold Voltage (Vgs(th)@Id): 1.5V@1mA; Total Gate Charge (Qg@Vgs): 2.4nC@25V; Input Capacitance (Ciss@Vds): 27pF@25V; Reverse Transfer Capacitance (Crss@Vds): 6pF; Operating Temperature: -55℃~+150℃
R34-R37 = ARG03DTC4702: Type:Thin Film Resistor Resistance: Tolerance:±0.5% Tolerance:±0.5% Power(Watts): Overload Voltage (Max): Temperature Coefficient:±25ppm/℃ Temperature Coefficient:±25ppm/℃ Operating Temperature Range:-55℃~+155℃ Operating Temperature Range:-55℃~+155℃; LCSC Part Name: 薄膜电阻 47kΩ ±0.5% 100mW; Supplier Part: C311914; Manufacturer: Viking(光颉); Supplier Footprint: 0603; JLCPCB Part Class: Extended Part; Datasheet: https://atta.szlcsc.com/upload/public/pdf/source/20200117/C485675_99063924B4564AF910B7BE66DA8EFA49.pdf; Supplier: LCSC; Type: Thin Film Resistor; Tolerance: ±0.5%; Temperature Coefficient: ±25ppm/℃; Operating Temperature Range: -55℃~+155℃
U5-U7 = TXB0104RUTR: Channel Type:Bi-Directional Input Signal:- Output Signal:- Data Rate:100Mbps Supply Voltage (VCCA):1.2V~3.6V Supply Voltage (VCCA):1.2V~3.6V Supply Voltage (VCCB):1.65V~5.5V Supply Voltage (VCCB):1.65V~5.5V Number of Circuits:1 Channels per Circuit:4 Outp; LCSC Part Name: 100Mbps 4位双向电平转换器; Supplier Part: C105266; Manufacturer: TI(德州仪器); Supplier Footprint: UQFN-12(1.7x2); Datasheet: https://www.ti.com/cn/lit/gpn/txb0104; Supplier: LCSC; Channel Type: Bi-Directional; Data Rate: 100Mbps; Supply Voltage (VCCA): 1.2V~3.6V; Supply Voltage (VCCB): 1.65V~5.5V; Number of Circuits: 1; Channels per Circuit: 4; Output Type: Tri-State；非反相; Operating Temperature: -40℃~+85℃; Features: 自动方向检测
U8 = PCAL6408AEX1Z: Interface:I2C；SMBus Interrupt Output:With Interrupt Output Output Type:Leakage；Push-pull type Supply Voltage:1.65V~5.5V Supply Voltage:1.65V~5.5V Output Source current:10mA Output Sink Current:25mA Clock Frequency:400kHz Operating Temperature:-40℃~+85℃ Op; Supplier Part: C2652343; Manufacturer: NXP(恩智浦); Supplier Footprint: X2-QFN-16(1.6x1.6); JLCPCB Part Class: Extended Part; Supplier: LCSC; Interface: I2C；SMBus; Interrupt Output: With Interrupt Output; Output Type: Leakage；Push-pull type; Supply Voltage: 1.65V~5.5V; Output Source current: 10mA; Output Sink Current: 25mA; Clock Frequency: 400kHz; Operating Temperature: -40℃~+85℃
U15 = PM254-2-20-Z-8.5: Holes Structure:2x20P Pitch:2.54mm Row Spacing:2.54mm Circular Hole / Square Hole:Square Holes Mounting Type:Straight Number of Rows:双排 Number of Holes:40P Current Rating (Max):3A Voltage Rating (Max):- Holes Direction:Top Insulation Height:8.5mm Contact; LCSC Part Name: 2x20P 间距:2.54mm 直插; Supplier Part: C2897421; Manufacturer: HCTL(华灿天禄); Supplier Footprint: 插件,P=2.54mm; JLCPCB Part Class: Extended Part; Datasheet: https://atta.szlcsc.com/upload/public/pdf/source/20230609/3D36CA2C1BFC9FD1C3F709AD9DFEB9C2.pdf; Supplier: LCSC; Holes Structure: 2x20P; Pitch: 2.54mm; Row Spacing: 2.54mm; Circular Hole / Square Hole: Square Holes; Mounting Type: Straight; Number of Rows: 双排; Number of Holes: 40P; Current Rating (Max): 3A; Holes Direction: Top; Insulation Height: 8.5mm; Contact Material: Copper Alloy; Operating Temperature Range: -40℃~+105℃; Soldering Temperature(Max): 260℃@5S
C38-C41 C129 = CL10A475KO8NNNC: Capacitance: Tolerance:±10% Tolerance:±10% Voltage Rated: Temperature Coefficient:; LCSC Part Name: 4.7uF ±10% 16V; Supplier Part: C19666; Manufacturer: SAMSUNG(三星); Supplier Footprint: 0603; Datasheet: https://atta.szlcsc.com/upload/public/pdf/source/20160218/1457707763339.pdf; Supplier: LCSC; Tolerance: ±10%
CN1 = SJ-3523-SMT-TR_C4991872: Current Rating (Max):1A Voltage Rating (Max):12V Contact Material:Brass；Copper alloy Contact Plating:Silver Operating Temperature Range:-25℃~+85℃ Operating Temperature Range:-25℃~+85℃; Supplier Part: C4991872; Manufacturer: CUI; JLCPCB Part Class: Extended Part; Datasheet: https://atta.szlcsc.com/upload/public/pdf/source/20240123/968F23FB1998F6BCBA9DDE00CF2E1130.pdf; Supplier: LCSC; Current Rating (Max): 1A; Voltage Rating (Max): 12V; Contact Material: Brass；Copper alloy; Contact Plating: Silver; Operating Temperature Range: -25℃~+85℃
U9 = TLV320DAC3101IRHBR: LCSC Part Name: 立体声D类音频功率放大器; Supplier Part: C2651664; Manufacturer: TI(德州仪器); Supplier Footprint: VQFN-32-EP(5x5); JLCPCB Part Class: Extended Part; Datasheet: https://www.ti.com/cn/lit/gpn/tlv320dac3101; Supplier: LCSC
C44 = C0603C471K5RACAUTO: Capacitance: Tolerance:±10% Tolerance:±10% Voltage Rated: Temperature Coefficient:; LCSC Part Name: 470pF ±10% 50V; Supplier Part: C129628; Manufacturer: KEMET(基美); Supplier Footprint: 0603; JLCPCB Part Class: Extended Part; Datasheet: https://atta.szlcsc.com/upload/public/pdf/source/20180326/C129691_620535B46A8EA2FB2DC0739E6AA6F36A.pdf; Supplier: LCSC; Tolerance: ±10%
C45 = CL10A226MQ8NRNC: Capacitance: Tolerance:±20% Tolerance:±20% Voltage Rated: Temperature Coefficient:; LCSC Part Name: 22uF ±20% 6.3V; Supplier Part: C59461; Manufacturer: SAMSUNG(三星); Supplier Footprint: 0603; Datasheet: https://atta.szlcsc.com/upload/public/pdf/source/20160218/1457707763339.pdf; Supplier: LCSC; Tolerance: ±20%
D3 D4 = PMEG2010AEH,115: Forward Voltage (Vf@If):430mV@1A Reverse Voltage (Vr):20V Average Rectified Current (Io):1A Reverse Leakage Current (Ir):200uA@20V; LCSC Part Name: 电压:20V 电流:1A; Supplier Part: C110921; Manufacturer: Nexperia(安世); Supplier Footprint: SOD-123F; JLCPCB Part Class: Extended Part; Datasheet: https://atta.szlcsc.com/upload/public/pdf/source/20170919/C110921_1505787026942976662.pdf; Supplier: LCSC; Forward Voltage (Vf@If): 430mV@1A; Reverse Voltage (Vr): 20V; Average Rectified Current (Io): 1A; Reverse Leakage Current (Ir): 200uA@20V
L1 = LQM2MPN1R5NG0L: Inductance: Tolerance:±30% Tolerance:±30% Rated Current: Saturation Current (Isat):- DC Resistance (DCR): Q @ Freq:- Frequency - Self Resonant: Ratings:; LCSC Part Name: 1.5uH ±30%; Supplier Part: C435418; Manufacturer: muRata(村田); Supplier Footprint: 0806; JLCPCB Part Class: Extended Part; Datasheet: https://atta.szlcsc.com/upload/public/pdf/source/20191009/C435418_382926478A3E95ADF08D0257401B37FE.pdf; Supplier: LCSC; Tolerance: ±30%
R52 = FRC0603P000 TS: Type:Thick Film Resistors Resistance: Tolerance:±5% Tolerance:±5% Power(Watts): Overload Voltage (Max): Operating Temperature Range:-55℃~+155℃ Operating Temperature Range:-55℃~+155℃; LCSC Part Name: 0Ω ±5% 100mW 厚膜电阻; Supplier Part: C2907080; Manufacturer: FOJAN(富捷); Supplier Footprint: 0603; JLCPCB Part Class: Extended Part; Datasheet: https://atta.szlcsc.com/upload/public/pdf/source/20211221/925EC7D7225764EE0046F22065062C87.pdf; Supplier: LCSC; Type: Thick Film Resistors; Tolerance: ±5%; Operating Temperature Range: -55℃~+155℃
R54 = AR03BTDX2002A: Type:Thin Film Resistor Resistance: Tolerance:±0.1% Tolerance:±0.1% Power(Watts): Overload Voltage (Max): Temperature Coefficient:±50ppm/℃ Temperature Coefficient:±50ppm/℃ Operating Temperature Range:-55℃~+155℃ Operating Temperature Range:-55℃~+155℃; LCSC Part Name: 薄膜电阻 20kΩ ±0.1% 62.5mW; Supplier Part: C374545; Manufacturer: Viking(光颉); Supplier Footprint: 0603; JLCPCB Part Class: Extended Part; Datasheet: https://atta.szlcsc.com/upload/public/pdf/source/20191129/C465721_10D49275DB41E427863CE9C8D788770A.pdf; Supplier: LCSC; Type: Thin Film Resistor; Tolerance: ±0.1%; Temperature Coefficient: ±50ppm/℃; Operating Temperature Range: -55℃~+155℃
U10 U44 = NCP114ASN180T1G: Output Type: Maximum Input Voltage:5.5V Output Voltage:1.8V Output Voltage:1.8V MAX Output Current:300mA Power Supply Rejection Ratio (PSRR):75dB@(1kHz) Dropout Voltage:- Output Polarity:Positive electrode Number of Outputs:1; LCSC Part Name: 输入5.5V 输出1.8V 300mA; Supplier Part: C233362; Manufacturer: onsemi(安森美); Supplier Footprint: TSOP-5-1.5mm; JLCPCB Part Class: Extended Part; Datasheet: https://atta.szlcsc.com/upload/public/pdf/source/20181108/C327507_DF1953E190AB296DCE3432D4CF8EDF1A.pdf; Supplier: LCSC; Maximum Input Voltage: 5.5V; Output Voltage: 1.8V; MAX Output Current: 300mA; Power Supply Rejection Ratio (PSRR): 75dB@(1kHz); Output Polarity: Positive electrode; Number of Outputs: 1
U16 = AP61102Z6-7: Function:Step-down type Output Type:Adjustable Input Voltage:2.3V~5.5V Input Voltage:2.3V~5.5V Output Voltage:600mV~3.6V Output Voltage:600mV~3.6V Output Current:1A Switching Frequency:2.2MHz Switching Frequency:2.2MHz Operating Temperature:-40℃~+85℃ Oper; LCSC Part Name: 2.3V至5.5V输入，1A低静态电流同步降压转换器; Supplier Part: C5224055; Manufacturer: DIODES(美台); Supplier Footprint: SOT-563; JLCPCB Part Class: Extended Part; Datasheet: https://atta.szlcsc.com/upload/public/pdf/source/20221027/AA29F244C14EB22CB2EF7E0A10B8AAD0.pdf; Supplier: LCSC; Function: Step-down type; Output Type: Adjustable; Input Voltage: 2.3V~5.5V; Output Voltage: 600mV~3.6V; Output Current: 1A; Switching Frequency: 2.2MHz; Operating Temperature: -40℃~+85℃; Synchronous Rectification: Yes; Number of Outputs: 1; Topology: Step-down; Switch tube (built-in/external): Built-in
C117-C119 C121 = 100nF: Supplier: LCSC; Supplier Part: C385964; Manufacturer: TAIYO YUDEN(太诱); Manufacturer Part: GMK107B7104KAHT; JLCPCB Part Class: Extended Part
C120 = 10uF: Supplier: LCSC; Supplier Part: C3039641; Manufacturer: muRata(村田); Manufacturer Part: GCM188D70J106ME36D; JLCPCB Part Class: Extended Part
C122 = 100nF: Supplier: LCSC; Manufacturer Part: CL05B104KO5NNNC; Manufacturer: SAMSUNG(三星); Supplier Part: C1525; JLCPCB Part Class: Basic Part
D5 D7 D8 = LESD5D5.0CT1G: Supplier: LCSC; Supplier Part: C383211; Manufacturer: Leshan Radio; JLCPCB Part Class: Extended Part
D6 = BAT760-7: Supplier: LCSC; Manufacturer: DIODES(美台); Supplier Part: C124187; JLCPCB Part Class: Extended Part
J3 = 105017-0001: Supplier: LCSC; Manufacturer: MOLEX; Supplier Part: C136000; JLCPCB Part Class: Extended Part
R27 R28 = 0Ω: Supplier: LCSC; Supplier Part: C2906974; Manufacturer: FOJAN(富捷); Manufacturer Part: FRC0603F0000TS; JLCPCB Part Class: Extended Part
R29 R32 = 10kΩ: Supplier: LCSC; Supplier Part: C167144; Manufacturer: UNI-ROYAL(厚声); Manufacturer Part: 0603WAD1002T5E; JLCPCB Part Class: Extended Part
SW9 SW10 = B3U-1000P: Supplier: LCSC; Supplier Part: C231329; Manufacturer: OMRON(欧姆龙); JLCPCB Part Class: Extended Part
U13 U40 = 10kΩ: Supplier: LCSC; Supplier Part: C5139509; Manufacturer: FH(风华); Manufacturer Part: ABD03K1002FT; JLCPCB Part Class: Extended Part
U22 U35 = S8050-MS: Supplier: LCSC; Supplier Part: C5120746; Manufacturer: MSKSEMI(美森科); JLCPCB Part Class: Extended Part
U34 = CH340K: Supplier: LCSC; Supplier Part: C968586; Manufacturer: WCH(南京沁恒); JLCPCB Part Class: Extended Part
U41 = ESP32-WROOM-32E-N4: LCSC Part Name: 通用型Wi-Fi+BT+BLE MCU模组; Supplier Part: C701341; Manufacturer: ESPRESSIF(乐鑫); Supplier Footprint: SMD,18x25.5mm; JLCPCB Part Class: Extended Part; Datasheet: https://atta.szlcsc.com/upload/public/pdf/source/20220601/0020821B65DE5740BBACA5FACC5CF3B6.pdf; Supplier: LCSC
U43 = PM254-1-10-Z-8.5: Holes Structure:1x10P Pitch:2.54mm Row Spacing:- Circular Hole / Square Hole:Square Holes Mounting Type:Straight Number of Rows:Plugin Number of Holes:10P Current Rating (Max):3A Voltage Rating (Max):- Holes Direction:Top Insulation Height:8.5mm Contact M; LCSC Part Name: 1x10P 间距:2.54mm 直插; Supplier Part: C2897373; Manufacturer: HCTL(华灿天禄); Supplier Footprint: 插件,P=2.54mm; JLCPCB Part Class: Extended Part; Datasheet: https://atta.szlcsc.com/upload/public/pdf/source/20230609/534BE42964C679BDE98E061007C4ABD6.pdf; Supplier: LCSC; Holes Structure: 1x10P; Pitch: 2.54mm; Circular Hole / Square Hole: Square Holes; Mounting Type: Straight; Number of Rows: Plugin; Number of Holes: 10P; Current Rating (Max): 3A; Holes Direction: Top; Insulation Height: 8.5mm; Contact Material: Copper Alloy; Operating Temperature Range: -40℃~+105℃; Soldering Temperature(Max): 260℃@5S

## Nets
1V8: C5.2 C6.2 C7.2 C24.2 C33.1 R43.2 U1.17(VDDIOB18) U1.26(VDDIOB18) U1.31(USB_VDD18) U9.3(DVDD) U14.1
3V3: C4.2 C8.2 C27.2 C28.2 C41.2 C117.2 C118.2 C129.2 R32.2 R44.2 R45.2 U1.30(USB_VDD33) U5.11(VCCB) U6.11(VCCB) U7.11(VCCB) U8.A2(VDD(I2C-bus)) U10.5(OUT) U34.7(VCC) U34.10(V3) U44.5(OUT)
3V3A: C35.1 C36.1 C37.1 C38.2 C39.2 C40.2 U9.17(AVDD) U9.18(DVSS) U9.21(SPLVDD) U9.24(SPRVDD)
5V: C42.2 C130.2 D3.1(K) D4.1(K) D6.1 R35.2 R37.2 R52.1 U10.1(IN) U10.3(EN) U44.1(IN) U44.3(EN)
+3.3V: C1.2 LED1.1(A) LED1.2(A)
+3V3: C119.1 C120.2 Q2.1(G) Q3.1(G) R29.2 R34.2 R36.2 U41.2(3V3)
GND: C1.1 C2.1 C3.1 C4.1 C5.1 C6.1 C7.1 C9.1 C10.1 C11.1 C12.1 C13.1 C14.1 C15.1 C16.1 C18.1 C19.1 C20.1 C21.1 C22.1 C23.1 C24.1 C25.1 C26.1 C33.2 C34.2 C35.2 C36.2 C37.2 C38.1 C39.1 C40.1 C41.1 C42.1 C43.1 C45.1 C117.1 C118.1 C119.2 C120.1 C121.2 C122.1 C129.1 C130.1 CN1.1 D2.2 D5.1 D7.1 D8.1 J3.5(GND) J3.6(EP) J3.7(EP) J3.8(EP) J3.9(EP) J3.10(EP) MIC1.4(SELECT) MIC1.5(GND) MIC2.4(SELECT) MIC2.5(GND) MIC3.4(SELECT) MIC3.5(GND) MIC4.4(SELECT) MIC4.5(GND) MIC5.4(SELECT) MIC5.5(GND) MIC6.4(SELECT) MIC6.5(GND) R4.1 R46.2 R47.2 R48.2 R49.1 R50.1 R51.1 R54.1 SW1.3(C) SW9.1 SW10.1 U4.4(GND) U5.6(GND) U6.6(GND) U6.7(B4) U6.8(B3) U6.9(B2) U7.6(GND) U8.B2(ADDR) U10.2(GND) U14.3 U14.5 U14.7 U14.9 U14.13 U14.15 U14.17 U14.19 U15.6 U15.9 U15.14 U15.20 U15.30 U15.34 U15.39 U16.2(GND) U34.3(GND) U34.11(EP) U41.1(GND) U41.39(GND) U42.4 U42.7 U42.10 U43.2 U43.3 U44.2(GND) USB1.5(GND) USB1.6(S) X1.2(GND) X1.4(GND)
VDD: C9.2 C10.2 C11.2 C12.2 C13.2 C14.2 C15.2 C16.2 C18.2 C44.2 C45.2 L1.2 R53.2 U1.4(VDD) U1.12(VDD) U1.19(VDD) U1.22(PLL_AVDD) U1.27(VDD) U1.34(VDD) U1.42(VDD) U1.49(VDD) U1.57(VDD) U1.61(VDD) U1.62(VDD) U1.63(VDD) U1.64(VDD)
VDDIO: C21.2 C22.2 C23.2 C25.2 C34.1 C123.2 C124.2 C125.2 C126.2 C127.2 C128.2 MIC2.2(VDD) MIC3.2(VDD) MIC4.2(VDD) MIC5.2(VDD) MIC6.2(VDD) R3.2 U1.6(X0D00) U1.8(VDDIOL) U1.38(VDDIOR) U1.52(VDDIOT) U4.8(VCC) U5.2(A1) U14.11 U42.1
VDDIO0: C29.2 C30.2 C31.2 U5.1(VCCA) U6.1(VCCA) U7.1(VCCA) U8.A3(VDD(P))
BCLK: U9.7(BCLK)
BOOT_SEL: R40.1 U8.D1(P3)
BUTA: R3.1 SW1.2(B) U1.11(X1D09)
D+: J3.3(D+) U34.1(UD+)
D-: D7.2 D8.2 J3.2(D-) U34.2(UD-)
DAC_RST: U1.40(X0D29) U1.44(X0D37)
DAC_RST_N: U8.C1(P2)
DIN_PRI: U9.5(DIN)
DIN_SEC: U9.32(GPIO1)
DN: D2.6 U1.28(USB_DM) USB1.3(Data+)
DP: D2.1 U1.29(USB_DP) USB1.2(Data-)
DTR: U34.4(DTR#) U35.2(E) U40.1
I2C_SCL: U1.47(X0D39)
I2C_SDA: U1.45(X0D38)
I2S_BCLK: U1.13(X1D10) U7.2(A1)
I2S_DATA0: U1.9(X1D00) U1.10(X1D01)
I2S_DATA1: U1.39(X1D22)
I2S_DATA2: U1.53(X1D34)
I2S_DIN: U7.5(A4)
I2S_DOUT: U7.4(A3)
I2S_LRCK: U7.3(A2)
I2S_OE: R48.1 U8.C4(P6)
INT_N: U1.55(X0D31) U8.C2(P1)
IO0: R32.1 SW10.2 U35.3(C) U41.25(IO0)
LED_G: U1.58(X0D33)
LED_R: U1.56(X0D32)
LEDG: R1.1
LEDR: R2.1
MCLK: U1.14(X1D11) U1.41(X0D35) U6.2(A1)
MCLK_OE: R47.1 U6.12(OE) U8.D3(P4)
MIC0_DATA: R42.2 U3.2(1A)
MIC1_DATA: R5.2 U3.3(1B) U3.5(2A)
MIC2_DATA: R14.2 U3.11(3A)
MIC3_DATA: R8.2 U3.13(4B) U3.14(4A)
MIC4_DATA: R9.2 U3.6(2B)
MIC5_DATA: R15.2 U3.10(3B)
MIC_CLK: U1.43(X0D36) U2.2(A) U42.3
MIC_DATA0: U1.46(X0D40) U42.5
MIC_DATA1: U1.50(X0D41) U42.6
MIC_DATA2: U1.48(X0D42) U42.8
MIC_DATA3: U1.51(X0D43) U42.9
MIC_OEN: U42.2
NET12: U3.4(1Y)
NET15: U3.7(2Y)
NET16: U3.8(GND)
NET17: U3.16(VCC)
NET18: U3.15(OE#)
NET21: U3.12(4Y)
NET24: U3.9(3Y)
PI_5V: D4.2(A) U15.2 U15.4
PI_I2C_SCL: Q2.2(S) R34.1 U8.A4(SCL) U15.5 U41.36(IO22)
PI_I2C_SDA: Q3.2(S) R36.1 U8.B3(SDA) U15.3 U41.33(IO21)
PI_I2S_BCLK: U7.10(B1) U15.12
PI_I2S_DIN: U7.7(B4) U15.38
PI_I2S_DOUT: U7.8(B3) U15.40
PI_I2S_LRCK: U7.9(B2) U15.35
PI_INT_N: R45.1 U8.B4(INT#) U15.13
PI_MCLK: U6.10(B1) U15.7
PI_SPI_CLK: U5.9(B2) U15.23
PI_SPI_CS_N: U5.10(B1) U15.24
PI_SPI_MISO: U5.7(B4) U15.21
PI_SPI_MOSI: U5.8(B3) U15.19
QSPI_CLK: U4.6(CLK)
QSPI_CS_N: U1.3(X0D01) U4.1(CS#)
QSPI_D0: U1.59(X0D04) U4.5(DI(IO0))
QSPI_D1: U4.2(DO(IO1))
QSPI_D2: U1.60(X0D06) U4.3(WP#(IO2))
QSPI_D3: U1.2(X0D07) U4.7(HOLD# or RESET#(IO3))
RESET: C121.1 R29.1 SW9.2 U22.3(C) U41.3(EN)
RESET_N: R49.2 U9.31(RESET#)
RST_N: C26.2 R43.1 U1.21(RST_N) U14.10
RTS: U13.1 U22.2(E) U34.6(RTS#)
RX_ESP: R28.2 U41.34(RXD0)
SCL: Q2.3(D) R35.1 U9.10(SCL)
SDA: Q3.3(D) R37.1 U9.9(SDA)
SPI_CLK: R41.1 U5.3(A2)
SPI_MISO: U5.5(A4)
SPI_MOSI: U1.7(X0D11) U5.4(A3)
SPI_OE: R46.1 U5.12(OE) U8.D4(P5)
SQL_NLIN: U1.54(X0D30)
TCK: U1.24(TCK) U14.4
TD0: U1.20(TDO)
TDI: U1.18(TDI) U14.8
TDO: U14.6
TMS: U1.23(TMS) U14.2
TX_ESP: R27.2 U41.35(TXD0)
USB_VBUS: C2.2 C3.2 D2.5 D3.2(A) R4.2 USB1.1(VBUS)
WCLK: U9.6(WCLK)
X1D13: U1.32(X1D13)
X1DN0: U1.35(X1D17) U14.14
X1DN1: U1.33(X1D16) U14.12
X1UP0: U1.36(X1D18) U14.16
X1UP1: U1.37(X1D19) U14.18
XVF_RST_N: U8.B1(P0)
Net-(C8-1): C8.1 C27.1 C28.1
Net-(C17-1): C17.1 CN1.3 R50.2
Net-(C17-2): C17.2 U9.30(HPR)
Net-(C19-2): C19.2 R39.1 X1.3(OSC2)
Net-(C20-2): C20.2 R38.2 U1.15(XOUT) X1.1(OSC1)
Net-(C29-1): C29.1 C30.1 C31.1
Net-(C32-1): C32.1 CN1.2 R51.2
Net-(C32-2): C32.2 U9.27(HPL)
Net-(C43-2): C43.2 R52.2 U16.3(VIN) U16.5(EN)
Net-(C44-1): C44.1 R53.1 R54.2 U16.1(FB)
Net-(C122-2): C122.2 D5.2 D6.2 J3.1(VCC)
Net-(C123-1): C123.1 C124.1 C125.1 C126.1 C127.1 C128.1
Net-(L1-1): L1.1 U16.4(SW)
Net-(LED1-3): LED1.3(K) R1.2
Net-(LED1-4): LED1.4(K) R2.2
Net-(MIC1-1): MIC1.1(DATA) R42.1
Net-(MIC1-3): MIC1.3(CLOCK) R6.2
Net-(MIC2-1): MIC2.1(DATA) R5.1
Net-(MIC2-3): MIC2.3(CLOCK) R7.2
Net-(MIC3-1): MIC3.1(DATA) R8.1
Net-(MIC3-3): MIC3.3(CLOCK) R10.2
Net-(MIC4-1): MIC4.1(DATA) R9.1
Net-(MIC4-3): MIC4.3(CLOCK) R16.2
Net-(MIC5-1): MIC5.1(DATA) R14.1
Net-(MIC5-3): MIC5.3(CLOCK) R11.2
Net-(MIC6-1): MIC6.1(DATA) R15.1
Net-(MIC6-3): MIC6.3(CLOCK) R13.2
Net-(R6-1): R6.1 R7.1 R10.1 R11.1 R12.2 R13.1 R16.1
Net-(R12-1): R12.1 U2.4(Y)
Net-(R27-1): R27.1 U34.9(RXD)
Net-(R28-1): R28.1 U34.8(TXD)
Net-(R38-1): R38.1 R39.2 U1.16(XIN)
Net-(R40-2): R40.2 U1.1(X0D05)
Net-(R41-2): R41.2 U1.5(X0D10)
Net-(R44-1): R44.1 U8.A1(RESET)
Net-(U13-2): U13.2 U35.1(B)
Net-(U22-1): U22.1(B) U40.2
Net-(U41-24): U41.24(IO2) U43.10
Net-(U41-26): U41.26(IO4) U43.9
Net-(U41-27): U41.27(IO16) U43.8
Net-(U41-28): U41.28(IO17) U43.7
Net-(U41-29): U41.29(IO5) U43.6
Net-(U41-30): U41.30(IO18) U43.5
Net-(U41-31): U41.31(IO19) U43.4
Net-(U41-37): U41.37(IO23) U43.1

Not connected (* = marked no-connect by the designer): D2 3* 4*; J3 4(ID)*; MIC1 2(VDD); SW1 1(A)* 4(D)*; U1 25(NC)* 65(VSS); U2 1(OE#) 3(GND) 5(VCC); U3 1(A#/B); U6 3(A2)* 4(A3)* 5(A4)*; U7 12(OE); U8 C3(P7) D2(VSS); U9 1(IOVSS) 2(IOVDD) 4(NC) 8(MCLK) 11(VOL/MICDET) 12(MICBIAS) 13(AIN1) 14(AIN2) 15(NC) 16(AVSS) 19(SPLM) 20(SPLVSS) 22(SPLP) 23(SPRM) 25(SPRVSS) 26(SPRP) 28(HPVDD) 29(HPVSS) 33(EP); U10 4(N/C); U14 20*; U15 1 8 10 11 15 16 17 18 22 25 26 27 28 29 31 32 33 36 37; U16 6(PG); U34 5(CTS#); U41 4(SENSOR_VP) 5(SENSOR_VN) 6(IO34) 7(IO35) 8(IO32) 9(IO33) 10(IO25) 11(IO26) 12(IO27) 13(IO14) 14(IO12) 15(GND) 16(IO13) 17(NC) 18(NC) 19(NC) 20(NC) 21(NC) 22(NC) 23(IO15) 32(NC) 38(GND); U44 4(N/C); USB1 4(ID)*

## Notes on the sheets
sheet 7
- ESP32 circuit
